# EAGLE board scoutfly (EAGLE 5.11), part 1 of 3
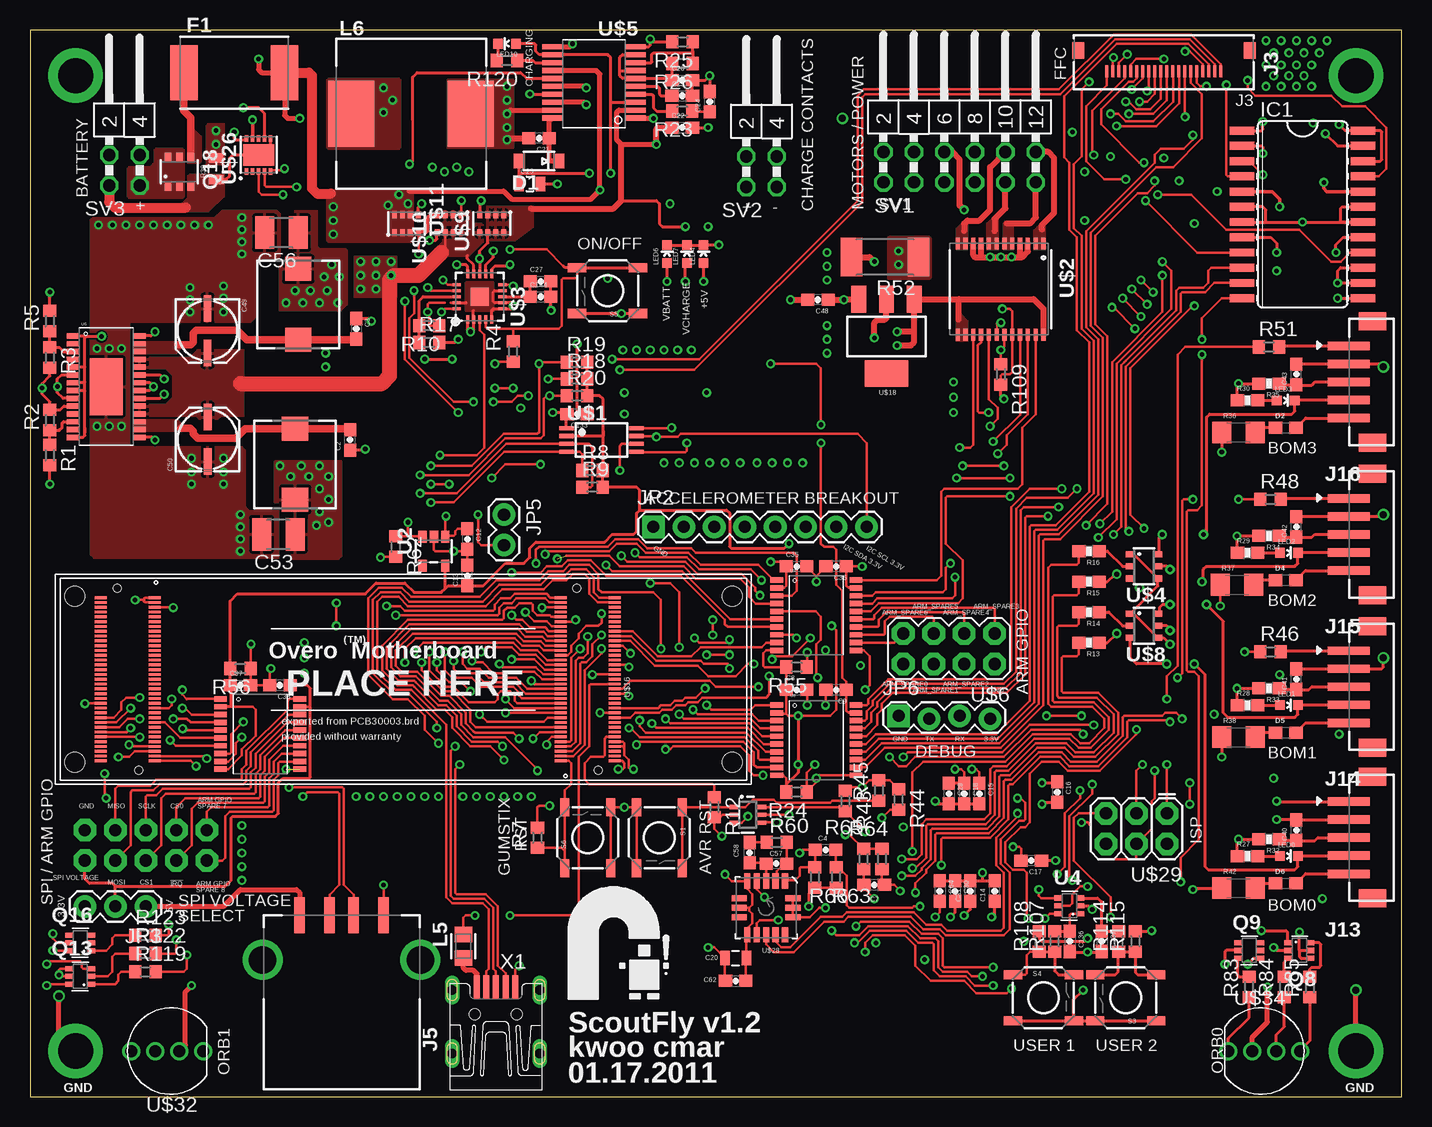
[diagram p7: board, top side]
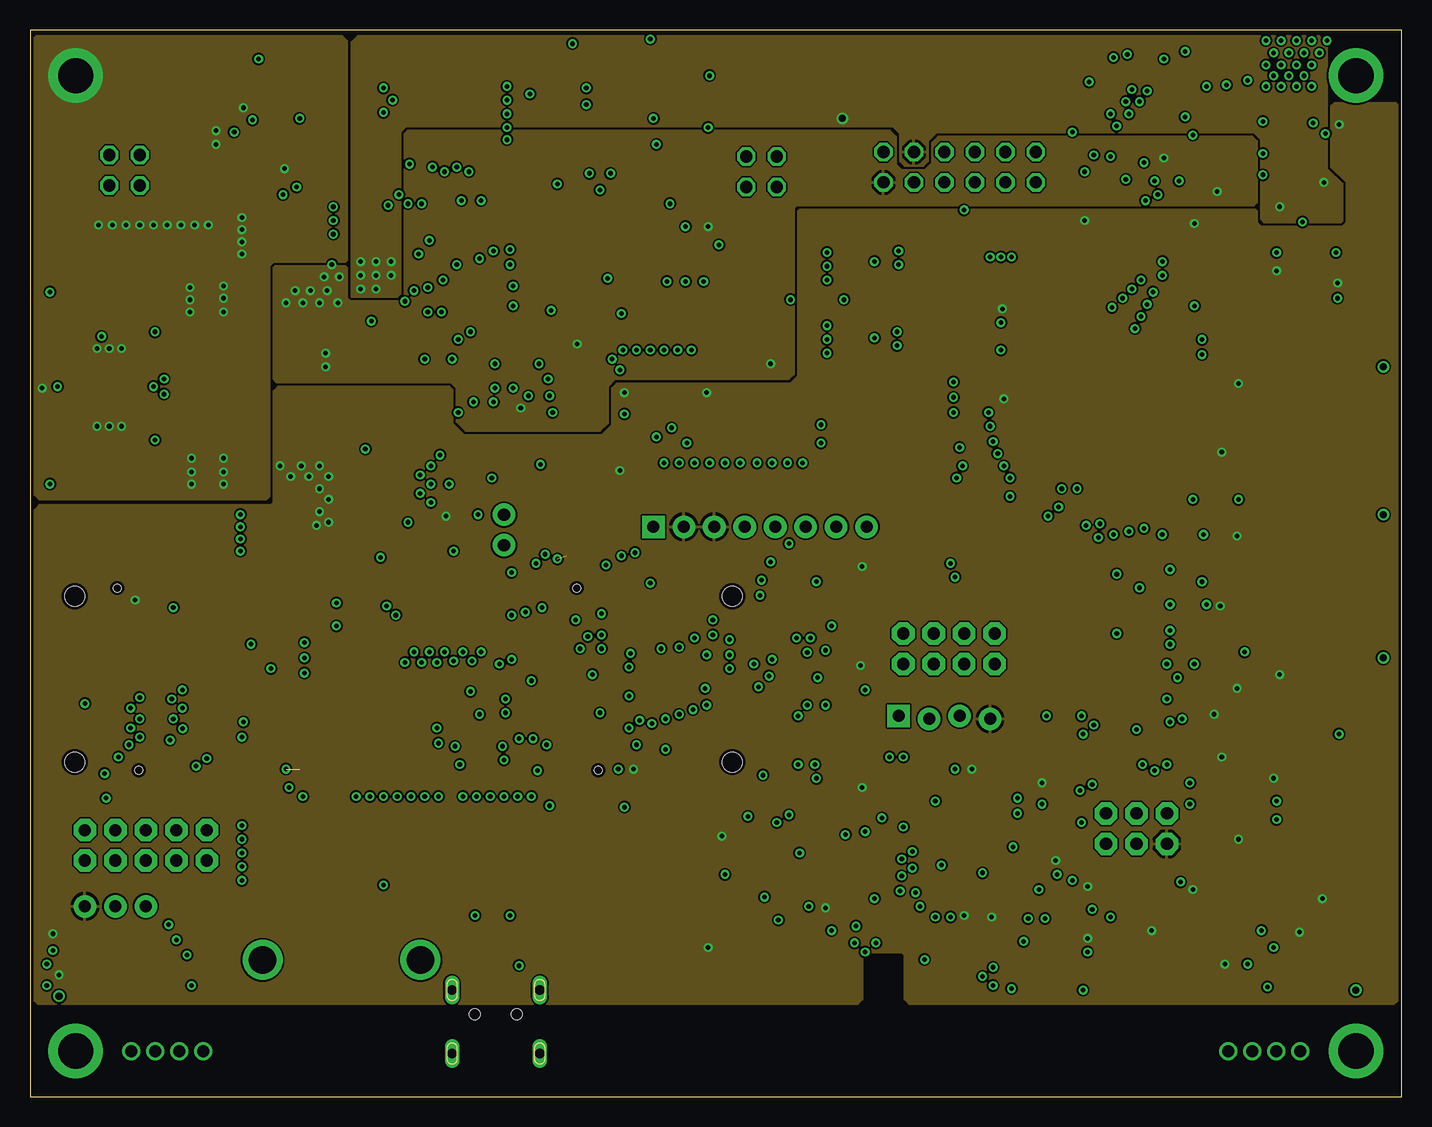
[diagram p8: board, inner layer Power]
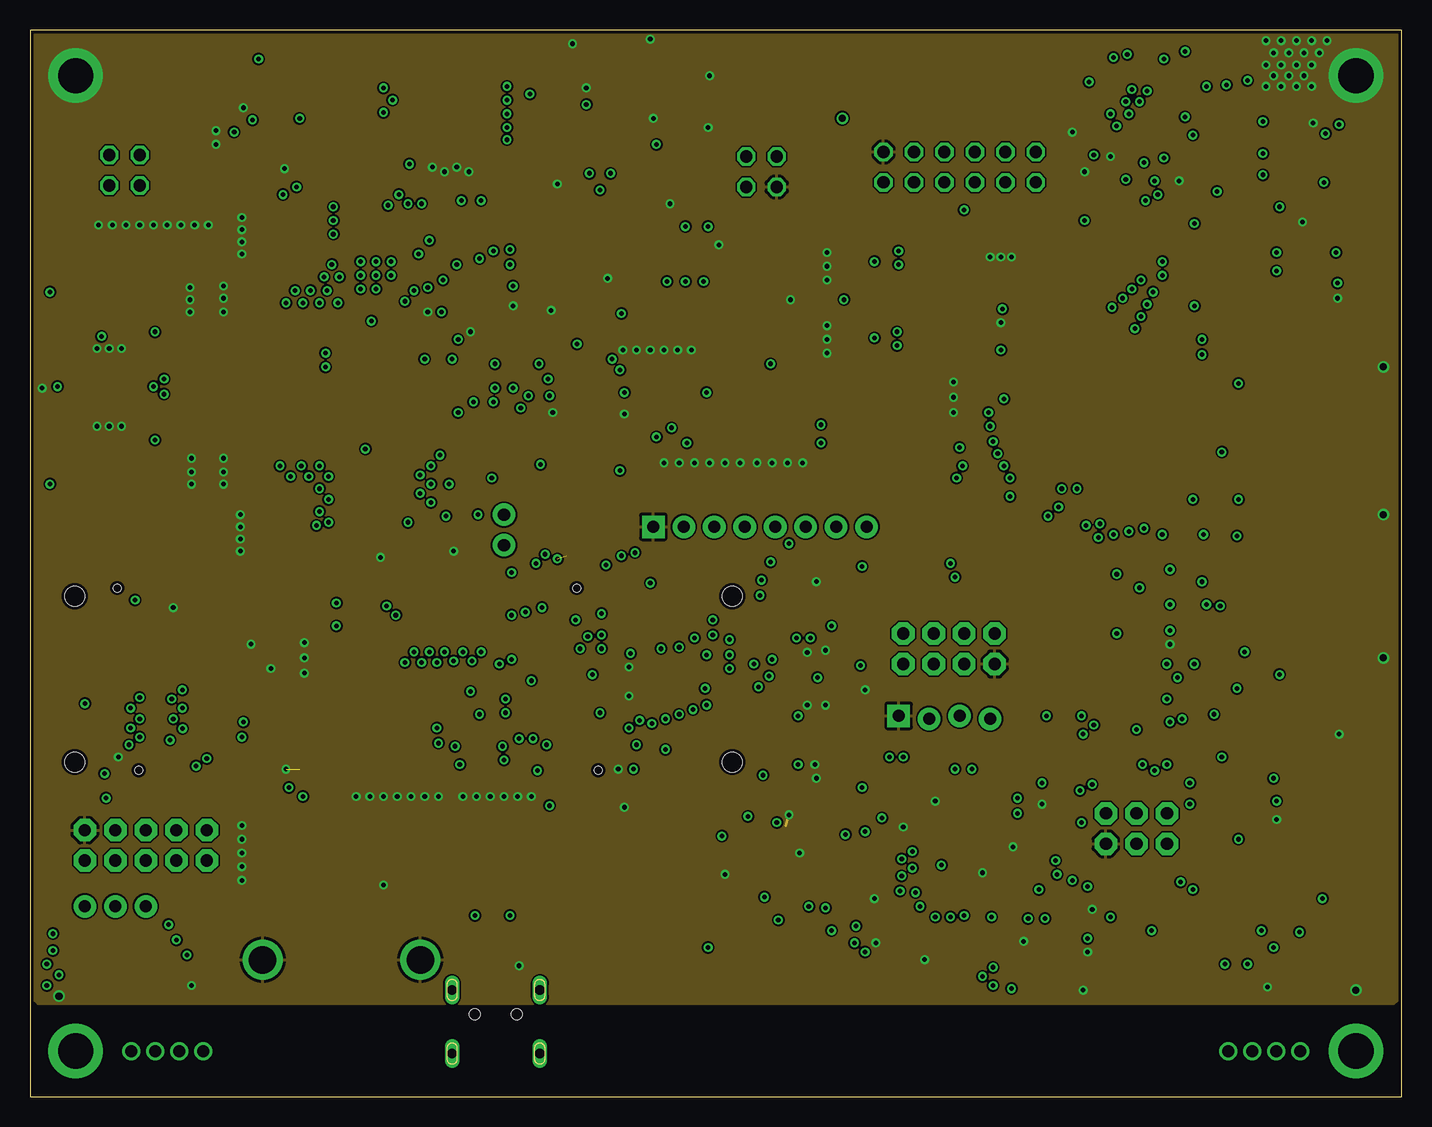
[diagram p9: board, inner layer GND]
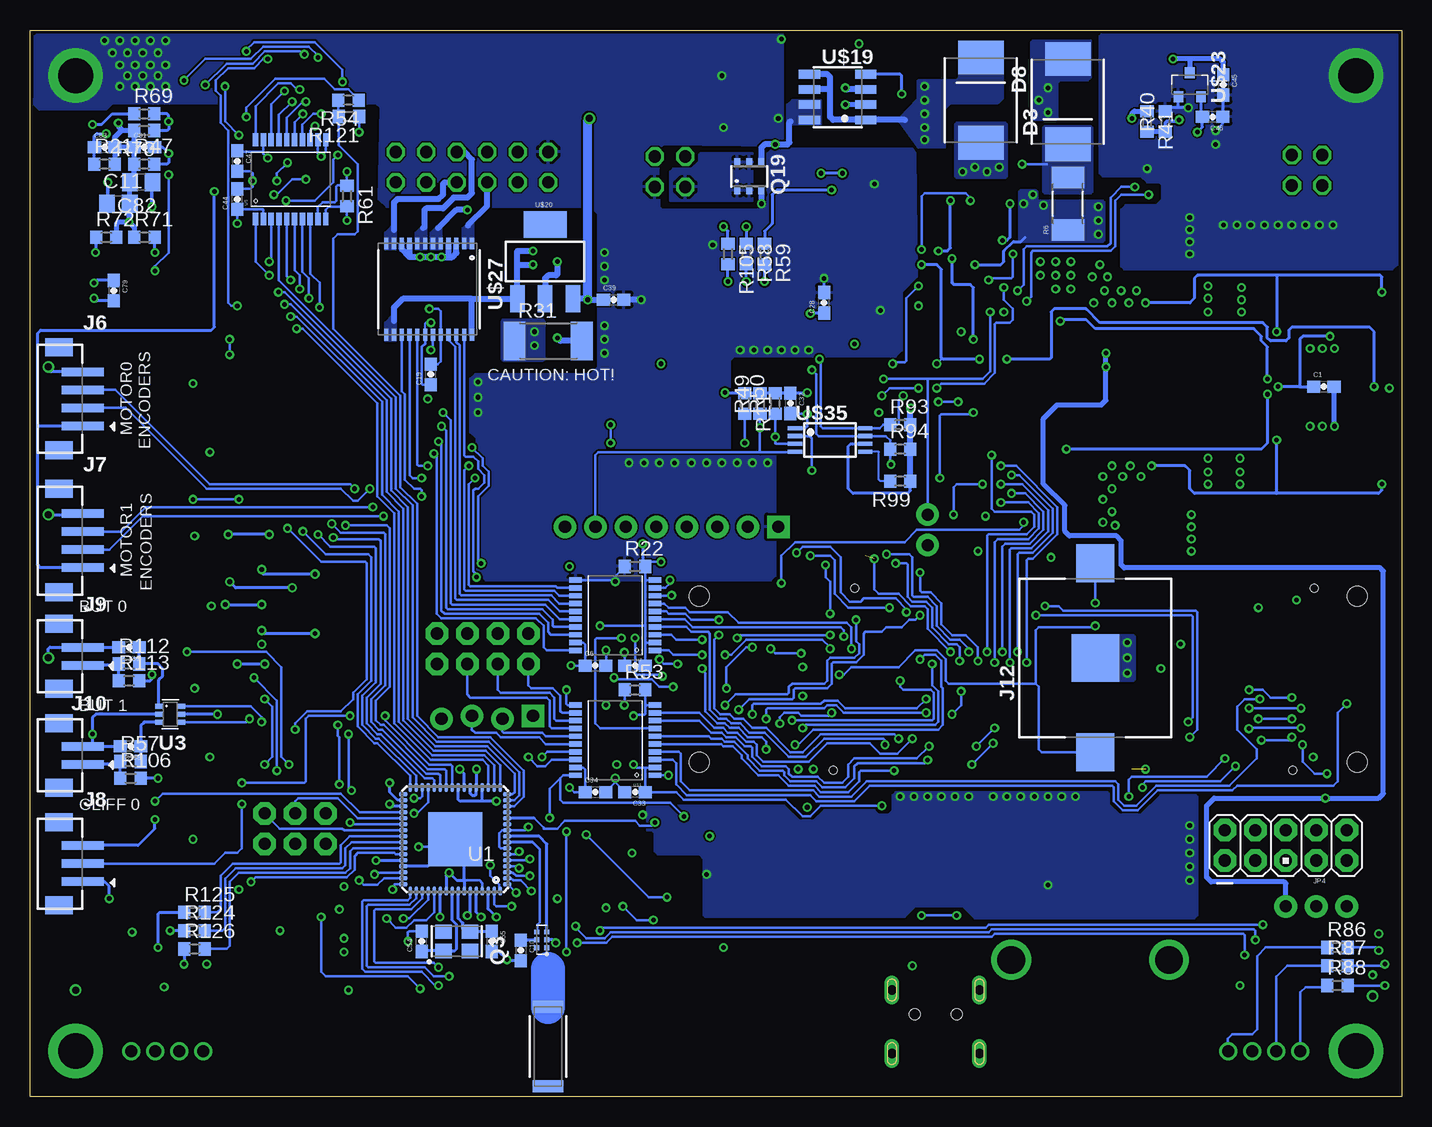
[diagram p10: board, bottom side, seen from below]

Size 114.3 x 88.9 mm. Coordinates in mm from the lower left corner, seen from the top.
Outline: 0,0 114.3,0 114.3,88.9 0,88.9 0,0
Copper layers (1*2+15*16): Top 0.0356mm / dielectric 1.5011mm / Power 0.0356mm / dielectric 0.1499mm / GND 0.0356mm / dielectric 0.2007mm / Bottom 0.0356mm
Design rules "4layer_6mil_15mil *": minimum track width 6mil, minimum drill 15mil, track to track 6mil, track to pad 6mil, pad to pad 6mil, via to via 6mil, smd to smd 6mil, copper to edge 10mil, drill to drill 8mil, minimum pad ring 7mil, minimum via ring 7mil, stop-mask expansion 4mil, vias tented up to drill 0mil, thermal gap 10mil

## Footprints (pad centres in the part's own frame; a part is rotated, then mirrored left to right if it is on the bottom)
CHIP_ANT_2.4GHZ = smd 1.016 x 2.54: 1 -3.302,0; 2 3.302,0
0603-CAP = smd 1.1 x 1: 1 -0.85,0; 2 0.85,0
C0805 = smd 1.3 x 1.5: 1 -0.95,0; 2 0.95,0
0805 = smd 0.8 x 1.2: 1 -0.9,0; 2 0.9,0
PANASONIC_C = smd 2.2 x 0.65: + 1.9,-0.2; - -1.8,-0.2
R1210 = smd 1.6 x 2.7: 1 -1.4,0; 2 1.4,0
SOD-123 = smd 0.914 x 1.219: 1 -1.638,0; 2 1.638,0
0603 = smd 1.1 x 1: 1 -0.85,0; 2 0.85,0
SMC/DO-214AB = smd 2.8 x 3.8: 1 -3.55,0; 2 3.55,0
SM200 = smd 2.3 x 4.6: 1 -4.2,0; 2 4.2,0
SO24W = smd 0.66 x 2.032: 1 -6.985,-5.029; 2 -5.715,-5.029; 3 -4.445,-5.029; 4 -3.175,-5.029; 5 -1.905,-5.029; 6 -0.635,-5.029; 7 0.635,-5.029; 8 1.905,-5.029; 9 3.175,-5.029; 10 4.445,-5.029; 11 5.715,-5.029; 12 6.985,-5.029; 13 6.985,5.029; 14 5.715,5.029; 15 4.445,5.029; 16 3.175,5.029; 17 1.905,5.029; 18 0.635,5.029; 19 -0.635,5.029; 20 -1.905,5.029; 21 -3.175,5.029; 22 -4.445,5.029; 23 -5.715,5.029; 24 -6.985,5.029
OMRON_XF = smd 0.25 x 1: 1 -4.75,0; 2 -4.25,0; 3 -3.75,0; 4 -3.25,0; 5 -2.75,0; 6 -2.25,0; 7 -1.75,0; 8 -1.25,0; 9 -0.75,0; 10 -0.25,0; 11 0.25,0; 12 0.75,0; 13 1.25,0; 14 1.75,0; 15 2.25,0; 16 2.75,0; 17 3.25,0; 18 3.75,0; 19 4.25,0; 20 4.75,0 | smd 1 x 1.34: SOLDER_PAD1 -7.14,-1.72; SOLDER_PAD2 7.14,-1.72
USB_A = smd 0.9 x 3: 1 -3.5,0; 2 -1,0; 3 1,0; 4 3.5,0 | drill 2.3 round: CASE1 -6.57,-3.71; CASE2 6.57,-3.71
JST_ZH_4 = smd 0.7 x 3.5: 1 -2.25,-2; 2 -0.75,-2; 3 0.75,-2; 4 2.25,-2 | smd 1.5 x 2.3: CASE1 -4.3,0; CASE2 4.3,0
JST_ZH_3 = smd 0.7 x 3.5: 1 -1.5,-2; 2 0,-2; 3 1.5,-2 | smd 1.5 x 2.3: CASE1 -3.45,0; CASE2 3.45,0
JST_ZH_2 = smd 0.7 x 3.5: 1 -0.75,-2; 2 0.75,-2 | smd 1.5 x 2.3: CASE1 -2.7,0; CASE2 2.7,0
COIN_CELL = smd 3.962 x 3.962: NEGATIVE 0,0 | smd 3.175 x 3.175: PLUS1 -7.874,0; PLUS2 7.874,0
JST_ZH_5 = smd 0.7 x 3.5: 1 -3.012,-2.508; 2 -1.512,-2.508; 3 -0.012,-2.508; 4 1.488,-2.508; 5 3.012,-2.508 | smd 1.5 x 2.3: CASE1 -5.062,-0.508; CASE2 5.062,-0.508
1X08 = drill 1.016 pad 1.88 square: 1 0,0 | drill 1.016 pad 1.88 round: 2 2.54,0; 3 5.08,0; 4 7.62,0; 5 10.16,0; 6 12.7,0; 7 15.24,0; 8 17.78,0
1X03 = drill 1.016 pad 1.88 round: 1 0,0; 2 2.54,0; 3 5.08,0
AVR_ICSP = drill 1.016 pad 1.88 octagon: 1 -1.27,5.08; 2 1.27,5.08; 3 -1.27,2.54; 4 1.27,2.54; 5 -1.27,0; 6 1.27,0; 7 -1.27,-2.54; 8 1.27,-2.54; 9 -1.27,-5.08; 10 1.27,-5.08
1X02 = drill 1.016 pad 1.88 round: 1 0,0; 2 2.54,0
1X04_LOCK = drill 1.016 pad 1.88 square: 1 0,0.127 | drill 1.016 pad 1.88 round: 2 2.54,-0.127; 3 5.08,0.127; 4 7.62,-0.127
WURTH_BALUN = smd 0.4 x 0.4: 1 -0.425,0.65; 2 -0.425,0; 3 -0.425,-0.65; 4 0.425,-0.65; 5 0.425,0; 6 0.425,0.65
RLF7030 = smd 2 x 2.2: 1 -2.95,0; 2 2.95,0
0805' = smd 1.285 x 1.47: 1 -0.973,0; 2 0.973,0
DR125 = smd 3.85 x 5.5: 1 -4.975,0; 2 4.975,0
LED-0603 = smd 0.8 x 0.8: A 0,-0.75; C 0,0.75
NX3225SA = smd 1.4 x 1.2: 1 -1.1,-0.8; 2 1.1,-0.8; 3 1.1,0.8; 4 -1.1,0.8
SOT363 = smd 0.42 x 0.6: 1 -0.65,-0.95; 2 0,-0.95; 3 0.65,-0.95; 4 0.65,0.95; 5 0,0.95; 6 -0.65,0.95
SOT26 = smd 0.55 x 0.8: 1 -0.95,-1.2; 2 0,-1.2; 3 0.95,-1.2; 4 0.95,1.2; 5 0,1.2; 6 -0.95,1.2
6-TSOP = smd 0.508 x 0.699: 1 -1.001,-1.163; 2 0,-1.163; 3 1.001,-1.163; 4 1.001,1.163; 5 0,1.163; 6 -1.001,1.163
R0603 = smd 1 x 1.1: 1 -0.85,0; 2 0.85,0
R2010 = smd 1.8 x 2.7: 1 -2.2,0; 2 2.2,0
0603-RES = smd 1.1 x 1: 1 -0.85,0; 2 0.85,0
R2512 = smd 1.8 x 3.2: 1 -2.8,0; 2 2.8,0
1206 = smd 1.6 x 1.8: 1 -1.4,0; 2 1.4,0
TACTILE_SWITCH_SMD = smd 1.524 x 0.762: 1 -2.54,1.905; 2 2.54,1.905; 3 -2.54,-1.905; 4 2.54,-1.905
MA06-2W = drill 1.016 octagon: 1 -7.62,-1.27; 2 -7.62,1.27; 3 -5.08,-1.27; 4 -5.08,1.27; 5 -2.54,-1.27; 6 -2.54,1.27; 7 0,-1.27; 8 0,1.27; 9 2.54,-1.27; 10 2.54,1.27; 11 5.08,-1.27; 12 5.08,1.27
MA02-2W = drill 1.016 octagon: 1 -1.27,-5.08; 2 -1.27,-2.54; 3 1.27,-5.08; 4 1.27,-2.54
MLF64-TH = smd 0.7 x 0.3: 1 -4.325,3.75; 2 -4.325,3.25; 3 -4.325,2.75; 4 -4.325,2.25; 5 -4.325,1.75; 6 -4.325,1.25; 7 -4.325,0.75; 8 -4.325,0.25; 9 -4.325,-0.25; 10 -4.325,-0.75; 11 -4.325,-1.25; 12 -4.325,-1.75; 13 -4.325,-2.25; 14 -4.325,-2.75; 15 -4.325,-3.25; 16 -4.325,-3.75; 33 4.325,-3.75; 34 4.325,-3.25; 35 4.325,-2.75; 36 4.325,-2.25; 37 4.325,-1.75; 38 4.325,-1.25; 39 4.325,-0.75; 40 4.325,-0.25; 41 4.325,0.25; 42 4.325,0.75; 43 4.325,1.25; 44 4.325,1.75; 45 4.325,2.25; 46 4.325,2.75; 47 4.325,3.25; 48 4.325,3.75 | smd 0.3 x 0.7: 17 -3.75,-4.325; 18 -3.25,-4.325; 19 -2.75,-4.325; 20 -2.25,-4.325; 21 -1.75,-4.325; 22 -1.25,-4.325; 23 -0.75,-4.325; 24 -0.25,-4.325; 25 0.25,-4.325; 26 0.75,-4.325; 27 1.25,-4.325; 28 1.75,-4.325; 29 2.25,-4.325; 30 2.75,-4.325; 31 3.25,-4.325; 32 3.75,-4.325; 49 3.75,4.325; 50 3.25,4.325; 51 2.75,4.325; 52 2.25,4.325; 53 1.75,4.325; 54 1.25,4.325; 55 0.75,4.325; 56 0.25,4.325; 57 -0.25,4.325; 58 -0.75,4.325; 59 -1.25,4.325; 60 -1.75,4.325; 61 -2.25,4.325; 62 -2.75,4.325; 63 -3.25,4.325; 64 -3.75,4.325 | smd 4.5 x 4.5: TH 0,0
5-SOT23 = smd 0.7 x 1: 1 -0.95,-1.2; 2 0,-1.2; 3 0.95,-1.2; 4 0.95,1.2; 5 -0.95,1.2
20-TSSOP = smd 1.05 x 0.45: 1 -3.3,2.925; 2 -3.3,2.275; 3 -3.3,1.625; 4 -3.3,0.975; 5 -3.3,0.325; 6 -3.3,-0.325; 7 -3.3,-0.975; 8 -3.3,-1.625; 9 -3.3,-2.275; 10 -3.3,-2.925; 11 3.3,-2.925; 12 3.3,-2.275; 13 3.3,-1.625; 14 3.3,-0.975; 15 3.3,-0.325; 16 3.3,0.325; 17 3.3,0.975; 18 3.3,1.625; 19 3.3,2.275; 20 3.3,2.925
TSSOP28 = smd 1.05 x 0.45: 1 -2.775,4.225; 2 -2.775,3.575; 3 -2.775,2.925; 4 -2.775,2.275; 5 -2.775,1.625; 6 -2.775,0.975; 7 -2.775,0.325; 8 -2.775,-0.325; 9 -2.775,-0.975; 10 -2.775,-1.625; 11 -2.775,-2.275; 12 -2.775,-2.925; 13 -2.775,-3.575; 14 -2.775,-4.225; 15 2.775,-4.225; 16 2.775,-3.575; 17 2.775,-2.925; 18 2.775,-2.275; 19 2.775,-1.625; 20 2.775,-0.975; 21 2.775,-0.325; 22 2.775,0.325; 23 2.775,0.975; 24 2.775,1.625; 25 2.775,2.275; 26 2.775,2.925; 27 2.775,3.575; 28 2.775,4.225 | smd 2.74 x 4.75: PAD 0,0
6-SOT23 = smd 0.35 x 0.85: 1 -0.65,-1.1; 2 0,-1.1; 3 0.65,-1.1; 4 0.65,1.1; 5 0,1.1; 6 -0.65,1.1
TSSOP8 = smd 1.2 x 0.35: 1 -2.925,0.975; 2 -2.925,0.325; 3 -2.925,-0.325; 4 -2.925,-0.975; 5 2.925,-0.975; 6 2.925,-0.325; 7 2.925,0.325; 8 2.925,0.975
24-SSOP = smd 0.35 x 0.97: 1 0,-3.81; 2 0.65,-3.81; 3 1.3,-3.81; 4 1.95,-3.81; 5 2.6,-3.81; 6 3.25,-3.81; 7 3.9,-3.81; 8 4.55,-3.81; 9 5.2,-3.81; 10 5.85,-3.81; 11 6.5,-3.81; 12 7.15,-3.81; 13 7.15,3.81; 14 6.5,3.81; 15 5.85,3.81; 16 5.2,3.81; 17 4.55,3.81; 18 3.9,3.81; 19 3.25,3.81; 20 2.6,3.81; 21 1.95,3.81; 22 1.3,3.81; 23 0.65,3.81; 24 0,3.81
20-QFN = smd 0.7 x 0.25: 1 -1.9,1; 2 -1.9,0.5; 3 -1.9,0; 4 -1.9,-0.5; 5 -1.9,-1; 11 1.9,-1; 12 1.9,-0.5; 13 1.9,0; 14 1.9,0.5; 15 1.9,1 | smd 0.25 x 0.7: 6 -1,-1.9; 7 -0.5,-1.9; 8 0,-1.9; 9 0.5,-1.9; 10 1,-1.9; 16 1,1.9; 17 0.5,1.9; 18 0,1.9; 19 -0.5,1.9; 20 -1,1.9 | smd 1.5 x 1.5: 21 0,0
20-SSOP = smd 1.651 x 0.432: 1 -3.48,5.944; 2 -3.48,5.283; 3 -3.48,4.623; 4 -3.48,3.962; 5 -3.48,3.302; 6 -3.48,2.642; 7 -3.48,1.981; 8 -3.48,1.321; 9 -3.48,0.66; 10 -3.48,0; 11 3.48,0; 12 3.48,0.66; 13 3.48,1.321; 14 3.48,1.981; 15 3.48,2.642; 16 3.48,3.302; 17 3.48,3.962; 18 3.48,4.623; 19 3.48,5.283; 20 3.48,5.944
2X4 = drill 1.016 pad 1.88 octagon: 1 -3.81,-1.27; 2 -3.81,1.27; 3 -1.27,-1.27; 4 -1.27,1.27; 5 1.27,-1.27; 6 1.27,1.27; 7 3.81,-1.27; 8 3.81,1.27
1206-8_CHIPFET = smd 0.406 x 0.559: 1 -0.991,-0.737; 2 -0.33,-0.737; 3 0.33,-0.737; 4 0.991,-0.737; 5 0.991,0.737; 6 0.33,0.737; 7 -0.33,0.737; 8 -0.991,0.737
OVERO = smd 1 x 0.23: ADCIN2 17.6,-2; ADCIN3 17.6,2; ADCIN4 17.6,5.2; ADCIN5 17.6,0.8; ADCIN6 17.6,0; ADCIN7 17.6,-4.4; AGND 17.6,1.2; AUXLF 17.6,6; AUXRF 17.6,4.8; EM_A1 -25.2,2; EM_A2 -20.7,2.8; EM_A3 -25.2,2.4; EM_A4 -25.2,3.2; EM_A5 -20.7,2; EM_A6 -25.2,1.6; EM_A7 -20.7,1.6; EM_A8 -20.7,2.4; EM_A9 -25.2,3.6; EM_A10 -25.2,2.8; EM_CLK -25.2,6.8; EM_D0 -25.2,1.2; EM_D1 -25.2,0; EM_D2 -20.7,1.2; EM_D3 -20.7,0.4; EM_D4 -20.7,-0.4; EM_D5 -20.7,-1.2; EM_D6 -25.2,-0.8; EM_D7 -25.2,-1.6; EM_D8 -25.2,0.4; EM_D9 -25.2,0.8; EM_D10 -20.7,0.8; EM_D11 -20.7,0; EM_D12 -20.7,-0.8; EM_D13 -25.2,-0.4; EM_D14 -25.2,-1.2; EM_D15 -20.7,-1.6; EM_NADV_ALE -20.7,4.4; EM_NBE0 -25.2,4.8; EM_NBE1 -25.2,6.4; EM_NCS0 -25.2,5.2; EM_NCS1 -25.2,4.4; EM_NCS4 -20.7,5.2; EM_NCS5_ETH0 -20.7,5.6; EM_NCS6 -25.2,5.6; EM_NOE -20.7,4; EM_NWE -20.7,4.8; EM_NWP -25.2,4; EM_WAIT0 -25.2,6; GND -20.7,6; GND@33 -20.7,-6; GND@56 17.6,-1.2; GND@70 17.6,-6.8; GPIO0_WAKEUP 13.1,-3.6; GPIO12_MMC3_CLK -25.2,-5.2; GPIO13_MMC3_CMD -20.7,-2; GPIO14_MMC3_DAT4 -20.7,-4.4; GPIO17_MMC3_D3 -20.7,-5.2; GPIO18_MMC3_D0 -20.7,-3.2; GPIO19_MMC3_D1 -25.2,-6.8; GPIO20_MMC3_D2 -25.2,-5.6; GPIO21_MMC3_DAT7 -20.7,-4.8; GPIO22_MMC3_DAT6 -25.2,-6.4; GPIO23_MMC3_DAT5 -25.2,-6; GPIO64_ETH0_NRESET -20.7,3.2; GPIO65_ETH1_IRQ1 -20.7,3.6; GPIO66_L_PCLK 13.1,5.6; GPIO67_L_LCLK 13.1,6.8; GPIO68_L_FCLK 13.1,6.4; GPIO69_L_BIAS 17.6,4; GPIO70_L_DD00 13.1,-6; GPIO71_L_DD01 13.1,-6.4; GPIO72_L_DD02 13.1,-4.8; GPIO73_L_DD03 13.1,-5.6; GPIO74_L_DD04 13.1,-4.4; GPIO75_L_DD05 13.1,-5.2; GPIO76_L_DD06 13.1,6; GPIO77_L_DD07 13.1,4.4; GPIO78_L_DD08 13.1,4.8; GPIO79_L_DD09 13.1,4; GPIO80_L_DD10 13.1,-2.8; GPIO81_L_DD11 13.1,-2.4; GPIO82_L_DD12 17.6,-2.8; GPIO83_L_DD13 13.1,-0.4; GPIO84_L_DD14 13.1,0.4; GPIO85_L_DD15 13.1,0.8; GPIO86_L_DD16 17.6,3.6; GPIO87_L_DD17 13.1,2.4; GPIO88_L_DD18 13.1,2.8; GPIO89_L_DD19 13.1,3.6; GPIO90_L_DD20 17.6,3.2; GPIO91_L_DD21 13.1,2; GPIO92_L_DD22 13.1,-1.2; GPIO93_L_DD23 17.6,-3.2; GPIO114_SPI1_NIRQ -25.2,-4.8; GPIO127_TS_IRQ 13.1,-4; GPIO128_GPS_PPS 13.1,-1.6; GPIO144_GPT9_PWM 13.1,0; GPIO145_GPT10_PWM 17.6,-0.8; GPIO146_GPT11_PWM 13.1,1.2; GPIO147_GPT8_PWM 13.1,-0.8; GPIO148_TXD1 -20.7,-2.4; GPIO149_MMC3_CD -25.2,-2.8; GPIO150_MMC3_WP -25.2,-2.4; GPIO151_RXD1 -25.2,-2; GPIO163_IR_CTS3 13.1,1.6; GPIO165_IR_RXD3 13.1,5.2; GPIO166_IR_TXD3 13.1,3.2; GPIO168_USBH_CPEN -20.7,-4; GPIO170_HDQ_1WIRE 17.6,2.4; GPIO171_SPI1_CLK -25.2,-4; GPIO172_SPI1_MOSI -25.2,-3.6; GPIO173_SPI1_MISO -25.2,-3.2; GPIO174_SPI1_CS0 -20.7,-3.6; GPIO175_SPI1_CS1 -25.2,-4.4; GPIO176_ETH0_IRQ -20.7,-2.8; GPIO184_I2C3_SCL 13.1,-2; GPIO185_I2C3_SDA 13.1,-3.2; HSOLF 17.6,-6; HSORF 17.6,-6.4; MIC_MAIN_MF 17.6,-1.6; MIC_SUB_MF 17.6,5.6; N_MANUAL_RESET 13.1,-6.8; NC@62 17.6,-3.6; NC@63 17.6,-4; POWERON 17.6,-4.8; PWM0 17.6,4.4; PWM1 17.6,1.6; SYSEN 17.6,-2.4; USBH_DM -20.7,-6.8; USBH_DP -20.7,-6.4; USBH_VBUS -20.7,-5.6; USBOTG_DM 17.6,6.4; USBOTG_DP 17.6,6.8; USBOTG_ID 17.6,2.8; USBOTG_VBUS 17.6,-0.4; VBACKUP 17.6,0.4; VSYSTEM@1 -20.7,6.8; VSYSTEM@2 -20.7,6.4; VSYSTEM@66 17.6,-5.2; VSYSTEM@67 17.6,-5.6 | hole 1.65: 27.4,6.9; 27.4,-6.9; -27.4,6.9; -27.4,-6.9 | hole 0.65: -23.85,7.6; -22.05,-7.6; 14.45,7.6; 16.25,-7.6
SOT223 = smd 1.219 x 2.235: 1 -2.311,-3.099; 2 0,-3.099; 3 2.311,-3.099 | smd 3.6 x 2.2: 4 0,3.099
8-SOIC = smd 0.72 x 1.78: 1 -1.905,-2.34; 2 -0.635,-2.34; 3 0.635,-2.34; 4 1.905,-2.34; 5 1.905,2.34; 6 0.635,2.34; 7 -0.635,2.34; 8 -1.905,2.34
SOT23 = smd 0.8 x 0.9: 1 -0.95,-1; 2 0.95,-1; 3 0,1
10-TDFN = smd 0.55 x 0.3: 1 -1.37,1; 2 -1.37,0.5; 3 -1.37,0; 4 -1.37,-0.5; 5 -1.37,-1; 6 1.37,-1; 7 1.37,-0.5; 8 1.37,0; 9 1.37,0.5; 10 1.37,1 | smd 1.8 x 2.6: 11 0,0
LGA16 = smd 1.27 x 0.508: 1 -2.235,1.575; 2 -2.235,0.787; 3 -2.235,0; 4 -2.235,-0.787; 5 -2.235,-1.575; 9 2.235,-1.575; 10 2.235,-0.787; 11 2.235,0; 12 2.235,0.787; 13 2.235,1.575 | smd 0.508 x 1.27: 6 -0.787,-2.235; 7 0,-2.235; 8 0.787,-2.235; 14 0.787,2.235; 15 0,2.235; 16 -0.787,2.235
2X3 = drill 1.016 pad 1.88 octagon: 1 0,0; 2 0,2.54; 3 2.54,0; 4 2.54,2.54; 5 5.08,0; 6 5.08,2.54
LED-TRICOLOR-THROUGHHOLE = drill 1 round: BLU 1,0; GND -1,0; GRN 3,0; RED -3,0
UX60-MB-5S8 = smd 2 x 0.5: 1 8.65,1.6; 2 8.65,0.8; 3 8.65,0; 4 8.65,-0.8; 5 8.65,-1.6 | drill 0.8 long: M1 3.1,-3.65; M2 3.1,3.65; M3 8.4,3.65; M4 8.4,-3.65 | hole 0.9: 6.4,-1.75; 6.4,1.75

## Placement (x,y rotation side)
A1  ANT-2.4-CHP  [CHIP_ANT_2.4GHZ]  71.12,4.19 270 bottom
C1  1uF  [0603-CAP]  6.48,59.18 0 bottom
C2  0.1uF  [0603-CAP]  26.67,54.74 90 top
C3  0.1uF  [0603-CAP]  27.18,64.01 270 top
C4  2.2uF  [0603-CAP]  66.29,20.57 180 top
C5  0.1uF  [0603-CAP]  63.88,35.94 180 bottom
C6  0.1uF  [0603-CAP]  67.18,35.94 0 bottom
C7  2.2uF  [0603-CAP]  70.36,17.65 180 top
C8  0.1uF  [0603-CAP]  63.88,33.91 0 top
C9  0.1uF  [0603-CAP]  67.18,33.91 180 top
C10  22pF  [0603-CAP]  73.41,12.19 270 bottom
C11  4.7uF  [C0805]  106.93,74.42 0 bottom
C12  1uF  [0603-CAP]  36.45,46.48 270 top
C13  1uF  [0603-CAP]  36.45,43.43 90 top
C14  1uF  [0603-CAP]  80.39,17.14 90 top
C15  1uF  [0603-CAP]  79.12,25.27 270 top
C16  1uF  [0603-CAP]  85.6,25.4 270 top
C17  1uF  [0603-CAP]  83.44,19.68 180 top
C18  1uF  [0603-CAP]  77.85,25.27 270 top
C19  0.1uF  [0603-CAP]  80.9,60.2 90 bottom
C20  10uF  [0805]  58.8,11.56 0 top
C21  0.1uF  [0603-CAP]  42.42,79.88 180 top
C22  0.1uF  [0603-CAP]  54.36,80.77 0 top
C23  4.7uF  [0805]  41.66,76.07 0 top
C24  0.1uF  [0603-CAP]  56.64,82.93 90 top
C25  0.047uF  [0603-CAP]  54.36,83.41 0 top
C26  0.1uF  [0603-CAP]  54.36,84.71 0 top
C27  0.1nF  [0603-CAP]  42.55,67.94 0 top
C28  0.1uF  [0603-CAP]  48.13,66.17 90 bottom
C29  1uF  [0603-CAP]  76.58,25.27 270 top
C30  1uF  [0603-CAP]  77.09,17.14 270 top
C31  1uF  [0603-CAP]  78.36,17.14 90 top
C32  0.1uF  [0603-CAP]  50.93,57.78 270 bottom
C33  0.1uF  [0603-CAP]  63.88,25.4 180 bottom
C34  0.1uF  [0603-CAP]  67.18,25.4 0 bottom
C35  0.1uF  [0603-CAP]  63.88,44.2 0 top
C36  0.1uF  [0603-CAP]  67.18,44.2 180 top
C37  0.1uF  [0603-CAP]  17.53,34.29 0 top
C38  0.1uF  [0603-CAP]  20.83,34.29 180 top
C39  0.1uF  [0603-CAP]  65.66,66.42 0 bottom
C40  0.1u  [0603-CAP]  105.54,22.23 90 top
C41  0.1u  [0603-CAP]  105.54,34.8 90 top
C42  0.1u  [0603-CAP]  105.54,47.5 90 top
C43  0.1u  [0603-CAP]  105.54,60.2 90 top
C44  0.1uF  [0603-CAP]  97.03,74.8 90 bottom
C45  1uF  [0603-CAP]  14.86,84.33 270 bottom
C46  1uF  [0603-CAP]  15.75,81.66 180 bottom
C47  0.1uF  [0603-CAP]  97.03,77.98 270 bottom
C48  0.1uF  [0603-CAP]  65.66,66.42 180 top
C49  47uF  [PANASONIC_C]  14.99,63.88 270 top
C50  47uF  [PANASONIC_C]  14.61,54.74 90 top
C53  22uF  [R1210]  20.7,46.86 180 top
C54  15pF  [0603-CAP]  81.66,12.95 90 bottom
C55  15pF  [0603-CAP]  75.82,12.95 270 bottom
C56  22uF  [R1210]  20.95,72.01 180 top
C57  0.01uF  [0603-CAP]  62.2,19.43 180 top
C58  0.47uF  [0603-CAP]  59.97,20.35 90 top
C62  0.1uF  [0603-CAP]  58.8,9.65 0 top
C64  0.1uF  [0603-CAP]  75.82,17.14 270 top
C79  0.1uF  [0603-CAP]  107.31,67.18 270 bottom
C81  680pF  [0603-CAP]  104.78,79.12 0 bottom
C82  4.7uF  [C0805]  105.03,76.2 180 bottom
C83  680pF  [0603-CAP]  108.08,79.12 0 bottom
C133  0.1uF  [0603-CAP]  45.59,56.9 180 top
C136  1uF  [0603-CAP]  86.65,12.95 270 top
C137  1uF  [0603-CAP]  89.32,12.95 270 top
C138  1uF  [0603-CAP]  105.92,29.21 180 bottom
C139  1uF  [0603-CAP]  106.05,37.47 180 bottom
C144  0.1nF  [0603-CAP]  42.55,66.67 0 top
D1  1N41482  [SOD-123]  42.42,77.98 0 top
D2  1V  [0603]  104.65,55.75 0 top
D3  MBRS340  [SMC/DO-214AB]  35.05,83.06 90 bottom
D4  1V  [0603]  104.65,43.05 0 top
D5  1V  [0603]  104.65,30.35 0 top
D6  1V  [0603]  104.65,17.78 0 top
D8  MBRS340  [SMC/DO-214AB]  27.81,82.93 270 bottom
F1  [SM200]  17.02,85.34 0 top
IC1  A3967SLB  [SO24W]  106.05,73.53 270 top
J3  XF2L  [OMRON_XF]  94.49,85.47 180 top
J5  USB_A  [USB_A]  25.96,15.12 0 top
J6  JST_4  [JST_ZH_4]  111.89,58.17 90 bottom
J7  JST_4  [JST_ZH_4]  111.89,46.35 90 bottom
J8  JST_3  [JST_ZH_3]  111.89,19.43 90 bottom
J9  JST_2  [JST_ZH_2]  111.89,36.7 90 bottom
J10  JST_2  [JST_ZH_2]  111.89,28.45 90 bottom
J12  KEYSTONE_3000  [COIN_CELL]  25.53,36.58 270 bottom
J13  JST_5VERT  [JST_ZH_5]  112.39,21.59 270 top
J14  JST_5VERT  [JST_ZH_5]  112.39,34.16 270 top
J15  JST_5VERT  [JST_ZH_5]  112.39,46.86 270 top
J16  JST_5VERT  [JST_ZH_5]  112.39,59.56 270 top
JP2  [1X08]  51.94,47.5 0 top
JP3  [1X03]  9.65,15.88 180 top
JP4  M05X2PTH  [AVR_ICSP]  9.65,20.95 90 bottom
JP5  [1X02]  39.5,48.51 270 top
JP6  [1X04_LOCK]  72.39,31.62 0 top
L1  WURTH_748421245  [WURTH_BALUN]  71.65,13.08 180 bottom
L2  1uH  [RLF7030]  22.1,52.7 90 top
L3  1.5uH  [RLF7030]  22.35,66.04 90 top
L5  MI0805K400R-10  [0805']  36.12,12.55 270 top
L6  22uH  [DR125]  31.75,81.92 0 top
LED0  GREEN  [LED-0603]  104.9,20.07 270 top
LED1  GREEN  [LED-0603]  104.9,32.64 270 top
LED2  GREEN  [LED-0603]  104.9,45.34 270 top
LED3  GREEN  [LED-0603]  104.65,58.04 270 top
LED4  Blue  [LED-0603]  56.13,70.23 0 top
LED6  Blue  [LED-0603]  53.09,70.23 0 top
LED7  Blue  [LED-0603]  54.74,70.23 0 top
LED10  Blue  [LED-0603]  39.75,87.76 90 top
Q3  16MHz  [NX3225SA]  78.74,12.95 0 bottom
Q8  DMMT3906W  [SOT363]  105.79,12.19 270 top
Q9  DMMT3906W  [SOT363]  101.6,12.19 90 top
Q13  DMMT3906W  [SOT363]  4.19,10.03 90 top
Q16  DMMT3906W  [SOT363]  4.19,12.83 90 top
Q18  DMP266LDM  [SOT26]  12.45,77.09 0 top
Q19  SI3493BDV  [6-TSOP]  54.36,76.71 0 bottom
R1  45.3K  [R0603]  1.65,53.47 270 top
R2  10K  [R0603]  1.65,56.39 90 top
R3  10K  [R0603]  1.65,61.59 270 top
R4  10K  [R0603]  40.26,62.1 90 top
R5  73.2K  [R0603]  1.65,64.64 90 top
R6  0.1, 1W  [R2010]  27.81,74.42 90 bottom
R7  10K  [R0603]  42.29,21.59 90 top
R8  487  [R0603]  46.86,52.2 0 top
R9  487  [R0603]  46.86,50.8 0 top
R10  100K  [R0603]  33.27,64.26 180 top
R11  200K  [R0603]  54.74,57.78 270 bottom
R12  10K  [R0603]  57.02,24.13 270 top
R13  2k  [0603-RES]  88.27,37.85 180 top
R14  2k  [0603-RES]  88.27,40.39 180 top
R15  2k  [0603-RES]  88.27,42.93 180 top
R16  2k  [0603-RES]  88.27,45.47 180 top
R17  845K  [R0603]  33.27,62.87 0 top
R18  10K  [R0603]  45.59,59.82 0 top
R19  10K  [R0603]  45.59,61.21 0 top
R20  10K  [R0603]  45.59,58.42 0 top
R21  20K  [R0603]  108.08,77.72 0 bottom
R22  10K  [R0603]  63.88,44.2 0 bottom
R23  10K  [R0603]  54.36,82.14 180 top
R24  10K  [R0603]  63.88,25.4 180 top
R25  100K  [R0603]  54.38,87.91 180 top
R26  100K  [R0603]  54.38,86.11 180 top
R27  68  [0603-RES]  101.47,20.07 0 top
R28  68  [0603-RES]  101.47,32.64 0 top
R29  68  [0603-RES]  101.47,45.34 0 top
R30  68  [0603-RES]  101.47,58.04 0 top
R31  0.8, > 1W  [R2512]  71.12,62.99 0 bottom
R32  100  [0603-RES]  103.25,21.46 180 top
R33  100  [0603-RES]  103.25,34.04 180 top
R34  100  [0603-RES]  103.25,46.74 180 top
R35  100  [0603-RES]  103.25,59.44 180 top
R36  4.7  [1206]  100.71,55.37 0 top
R37  4.7  [1206]  100.58,42.67 0 top
R38  4.7  [1206]  100.71,29.97 0 top
R39  0.01, 1%, 1/4W  [0805]  15.49,77.34 90 top
R40  49.9K  [R0603]  19.68,81.28 90 bottom
R41  49.9K  [R0603]  21.21,81.28 270 bottom
R42  4.7  [1206]  100.71,17.4 0 top
R43  10K  [R0603]  67.94,24.64 270 top
R44  10K  [R0603]  72.39,24.77 270 top
R45  10K  [R0603]  70.74,25.53 90 top
R46  10K  [R0603]  103.38,37.08 0 top
R47  20K  [R0603]  104.78,77.72 0 bottom
R48  10K  [R0603]  103.38,49.78 0 top
R49  976  [R0603]  53.47,57.78 90 bottom
R50  976  [R0603]  52.2,57.78 90 bottom
R51  10K  [R0603]  103.25,62.48 0 top
R52  0.8, > 1W  [R2512]  71.25,69.98 180 top
R53  10K  [R0603]  63.88,33.91 0 bottom
R54  5.11K  [R0603]  87.76,83.06 180 bottom
R55  10K  [R0603]  63.88,35.81 180 top
R56  10K  [R0603]  17.53,35.69 180 top
R57  30.1K  [R0603]  105.92,27.94 0 bottom
R58  432  [R0603]  54.61,70.23 270 bottom
R59  182  [R0603]  53.09,70.23 270 bottom
R60  10K  [R0603]  62.23,21.21 180 top
R61  10K  [R0603]  87.88,75.06 270 bottom
R62  10K  [R0603]  30.48,45.85 270 top
R63  33K  [R0603]  67.18,18.29 270 top
R64  33K  [R0603]  70.99,19.81 90 top
R65  1M  [R0603]  69.47,19.81 90 top
R66  1M  [R0603]  65.41,18.29 270 top
R69  9.76K  [R0603]  104.78,81.92 0 bottom
R70  442  [R0603]  104.78,80.52 180 bottom
R71  0.05  [R0603]  104.75,71.63 0 bottom
R72  0.05  [R0603]  107.95,71.63 0 bottom
R83  64.9  [R0603]  101.6,9.14 90 top
R84  18  [R0603]  104.52,9.14 90 top
R85  18  [R0603]  106.65,9.14 90 top
R86  64.9  [R0603]  5.33,12.45 0 bottom
R87  18  [R0603]  5.33,10.92 0 bottom
R88  18  [R0603]  5.33,9.27 0 bottom
R93  1.54K  [R0603]  41.78,56.01 0 bottom
R94  1.54K  [R0603]  41.78,53.98 0 bottom
R99  200K  [R0603]  41.78,51.31 180 bottom
R105  84.5  [R0603]  56.13,70.23 270 bottom
R106  32.4k  [R0603]  105.92,26.54 0 bottom
R107  30.1K  [R0603]  85.38,12.95 90 top
R108  32.4k  [R0603]  84.11,12.95 90 top
R109  10K  [R0603]  80.9,60.2 270 top
R112  30.1K  [R0603]  106.05,36.07 0 bottom
R113  32.4k  [R0603]  106.05,34.67 0 bottom
R114  30.1K  [R0603]  90.72,12.95 90 top
R115  32.4k  [R0603]  92.12,12.95 90 top
R119  10K  [R0603]  9.63,10.41 0 top
R120  105  [R0603]  39.75,86.36 180 top
R121  10K  [R0603]  87.73,81.69 180 bottom
R122  10K  [R0603]  9.63,11.94 0 top
R123  10K  [R0603]  9.63,13.46 0 top
R124  10K  [R0603]  100.58,13.84 0 bottom
R125  10K  [R0603]  100.58,15.37 0 bottom
R126  10K  [R0603]  100.58,12.32 0 bottom
S1  [TACTILE_SWITCH_SMD]  52.45,21.59 270 top
S3  [TACTILE_SWITCH_SMD]  91.31,8.26 180 top
S4  [TACTILE_SWITCH_SMD]  84.45,8.26 0 top
S5  [TACTILE_SWITCH_SMD]  48.13,67.18 180 top
S6  [TACTILE_SWITCH_SMD]  46.48,21.59 90 top
SV1  [MA06-2W]  78.74,77.47 0 top
SV2  MA02-2W  [MA02-2W]  60.96,80.9 0 top
SV3  MA02-2W  [MA02-2W]  7.87,81.03 0 top
U1  ATMEGA128RF  [MLF64-TH]  78.87,21.46 180 bottom
U2  TC1015  [5-SOT23]  33.66,45.47 180 top
U3  NL27WZ14  [SOT363]  102.62,31.88 270 bottom
U4  NL27WZ14  [SOT363]  86.61,15.92 90 top
U5  TXB0108  [20-TSSOP]  92.58,76.45 90 bottom
U6  LTC3633  [TSSOP28]  6.35,59.18 0 top
U7  TXB0108  [20-TSSOP]  65.53,40.13 180 bottom
U8  TXB0108  [20-TSSOP]  65.53,29.72 0 top
U9  TXB0108  [20-TSSOP]  65.53,40.13 0 top
U10  TXB0108  [20-TSSOP]  19.18,30.23 0 top
U11  TXB0108  [20-TSSOP]  65.53,29.72 180 bottom
U12  74LVC1G11  [6-SOT23]  59.82,23.5 270 top
U$1  PCA9306  [TSSOP8]  47.62,54.74 0 top
U$2  TB6612FNG  [24-SSOP]  84.45,67.31 180 top
U$3  LTC2952  [20-QFN]  37.47,66.67 90 top
U$4  BC817DS  [6-TSOP]  92.84,44.2 270 top
U$5  MAX745  [20-SSOP]  46.99,87.5 180 top
U$6  M04X2  [2X4]  76.58,37.34 180 top
U$7  ROBOLOGOSILKSCREEN  [RCLOGO]  48.64,11.18 0 top
U$8  BC817DS  [6-TSOP]  92.84,39.24 270 top
U$9  SI5401DC  [1206-8_CHIPFET]  38.48,72.77 180 top
U$10  SI5401DC  [1206-8_CHIPFET]  34.92,72.77 180 top
U$11  SI5401DC  [1206-8_CHIPFET]  31.37,72.77 0 top
U$16  OVERO  [OVERO]  31.11,34.8 0 top
U$18  V_REG_317SMD  [SOT223]  71.37,63.37 180 top
U$19  IRF7303  [8-SOIC]  46.99,83.31 90 bottom
U$20  V_REG_317SMD  [SOT223]  71.37,69.6 0 bottom
U$23  MCP1702  [SOT23]  17.65,84.33 0 bottom
U$26  DS2786  [10-TDFN]  19.05,78.49 90 top
U$27  TB6612FNG  [24-SSOP]  77.47,67.31 180 bottom
U$28  LPY5150AL  [LGA16]  61.34,15.75 270 top
U$29  AVR_SPI_PRG_6PTH  [2X3]  94.74,23.62 180 top
U$32  LED-TRICOLOR-THROUGHHOLE  [LED-TRICOLOR-THROUGHHOLE]  11.43,3.81 180 top
U$34  LED-TRICOLOR-THROUGHHOLE  [LED-TRICOLOR-THROUGHHOLE]  102.87,3.81 0 top
U$35  PCA9306  [TSSOP8]  47.62,54.74 0 bottom
X1  MINI-USB-UX60-MB-5S8  [UX60-MB-5S8]  38.83,0.5 90 top

## Tracks (layer width: path | path; a pad name or v marks a point on that pad's centre or on a via)
!ARM_RESET
  Top 0.203: U$16.N_MANUAL_RESET 44.9,28 45.09,27.81 45.09,26.04 44.58,25.53 S6.2 44.58,20.07 | 44.58,20.07 44.58,20.45 44.28,20.74 R7.1 | 44.58,20.07 S6.1
!AVR_ISP_RST  (via drill 0.38)
  Top 0.203: v90.04,14.99 90.04,16.64 87,19.68 87,23.24 87.38,23.62 U$29.5 | v81.79,9.02 81.41,8.64 78.87,8.64 77.85,9.65 75.06,9.65 73.79,10.92 73.79,12.57 72.9,13.46 70.23,13.46 69.6,12.83 v69.6,12.06 | v69.6,22.1 69.6,22.14 R43.2 | 67.65,24.13 67.65,24.08 R43.2 | U12.6 67.59,24.14 R43.2
  Bottom 0.203: v90.04,14.99 90.04,10.41 89.66,10.03 82.8,10.03 v81.79,9.02 | v69.6,12.06 v69.6,22.1
!AVR_RESET  (via drill 0.38)
  Top 0.203: v62.23,22.86 60.93,22.86 U12.4
  Bottom 0.203: 72.29,23.21 71.5,22.42 71.5,22.35 70.36,22.35 69.72,22.99 63.88,22.99 63.5,22.61 62.48,22.61 v62.23,22.86
  Bottom 0.254: 72.29,23.21 U1.12
!AVR_RESET_1.8V  (via drill 0.38)
  Top 0.203: U$16.GPIO86_L_DD16 50.12,38.4 52.2,36.32 55.88,36.32 56.13,36.07 58.17,36.07 58.29,35.94 v58.29,35.69 | v52.96,28.96 53.34,28.96 53.59,29.21 59.18,29.21 59.94,28.45 59.94,27.18 60.33,26.8 v61.09,26.8
  Bottom 0.203: v58.29,35.69 58.29,35.56 58.04,35.31 58.04,32.13 57.02,31.11 56.39,31.11 56.01,30.73 55.24,30.73 54.48,29.97 53.34,29.97 52.96,29.59 v52.96,28.96 | U11.1 v61.09,26.8 U11.1
  Bottom 0.254: U11.1
!AVR_RESET_3.3V  (via drill 0.38)
  Top 0.203: R44.2 71.67,23.91 v70.99,23.24 | U12.3 59.29,22.84 v59.82,23.37
  Bottom 0.203: U11.20 69.85,26.79 70.1,26.54 | 70.1,26.54 70.1,24.77 69.85,24.51 60.96,24.51 v59.82,23.37 | v70.99,23.24 70.99,25.65 70.1,26.54
!PWR_BATT  (via drill 0.38)
  Top 0.203: U$16.GPIO163_IR_CTS3 43.1,36.4 42.29,37.21 40.89,37.21 40.26,37.85 32.77,37.85 v32,37.08 | v32.51,51.82 36.58,51.82 39.62,54.86 42.55,54.86 42.8,55.12 42.8,58.17 43.05,58.42 v43.31,58.42 R20.1 | U$3.17 33.41,67.17 v33.15,67.44 | v40.26,59.05 v38.73,59.05
  Bottom 0.203: v32,37.08 32,45.21 31.88,45.34 30.73,45.34 29.08,46.99 29.08,49.02 31.88,51.82 v32.51,51.82 | v33.15,67.44 33.15,66.42 32.38,65.66 32.38,64.77 32.64,64.52 33.78,64.52 33.91,64.39 33.91,60.33 34.8,59.44 38.35,59.44 v38.73,59.05 | v40.26,59.05 42.67,59.05 v43.31,58.42
!PWR_INT  (via drill 0.38)
  Top 0.203: U$16.GPIO87_L_DD17 42.81,37.2 42.42,37.59 41.02,37.59 40.39,38.23 32.13,38.23 31.24,37.34 v31.24,36.2 | v33.4,52.58 36.83,52.58 39.5,55.24 42.29,55.24 42.42,55.37 v42.42,61.09 42.55,61.21 R19.1 | U$3.10 40.15,67.67 v40.26,67.56
  Bottom 0.203: v31.24,36.2 31.24,44.7 31.11,44.83 30.73,44.83 28.7,46.86 28.7,49.15 32.13,52.58 v33.4,52.58 | v40.26,67.56 41.27,66.55 41.27,61.34 41.4,61.21 42.29,61.21 v42.42,61.09
!PWR_KILL  (via drill 0.38)
  Top 0.203: U$16.GPIO127_TS_IRQ 37.15,30.8 36.7,31.24 36.7,32.26 35.18,33.78 34.42,33.78 32.64,35.56 v32.64,36.2 | v33.4,51.05 v34.92,51.05 | v37.34,48.51 37.34,46.23 37.59,45.97 JP5.2
  Bottom 0.203: v32.64,36.2 32.64,45.59 32.51,45.72 30.86,45.72 29.46,47.12 29.46,48.9 31.62,51.05 v33.4,51.05 | v34.92,51.05 37.08,51.05 37.34,50.8 v37.34,48.51
!SPI_IRQ
  Top 0.203: JP4.3 13.46,20.95 13.46,24 13.97,24.51 19.43,24.51 19.56,24.64 19.56,26.67 19.94,27.05 19.94,28.07 21.12,29.25 U10.14
!SPI_IRQ_1.8V  (via drill 0.38)
  Top 0.203: U10.7 12.15,29.25 v11.68,29.72 | U$16.GPIO114_SPI1_NIRQ 9.12,30 v9.14,29.97
  Bottom 0.203: v11.68,29.72 9.4,29.72 v9.14,29.97
!VBATT_GATE  (via drill 0.38)
  Top 0.254: U$9.4 37.49,74.57 v37.59,74.68 | U$3.12 37.97,69.33 38.61,69.98 v38.61,70.48
  Bottom 0.254: v37.59,74.68 37.59,70.74 37.85,70.48 v38.61,70.48
+1.8V  (via drill 0.38)
  Top 0.203: 63.03,31.92 R53.2 R55.2 61.21,35.81 61.09,35.94 61.09,36.96 61.34,37.21 U9.10 | U8.2 62.24,32 62.33,31.92 63.03,31.92 | U9.2 62.24,42.42 62.87,42.42 63.03,42.58 R22.2 62.65,44.58 v61.72,44.58 | U8.10 62.78,26.79 63.03,26.54 R24.2 | 63.03,31.92 63.2,31.75 v64.01,31.75 66.67,31.75 67.18,32.26 67.18,38.86 v66.8,39.24 | R7.2 42.29,24.13 42.42,24.26 v43.31,24.26 | U10.10 16.51,27.3 17.65,28.45 17.65,28.96 18.8,30.1 18.8,32.26 18.54,32.51 16.76,32.51
  Top 0.254: 34.6,42.35 U2.5 | 34.6,42.35 34.29,42.04 32,42.04 31.24,42.8 28.83,42.8 27.94,41.91 17.27,41.91 16.68,41.31 R56.2 C37.1 16.76,34.2 16.76,32.51 15.89,32.51 U10.2 | U10.10 | 34.6,42.35 34.84,42.58 C13.1 37.76,42.58 39.62,44.45 41.15,44.45 41.66,44.96 41.66,45.72 42.16,46.23 47.88,46.23 48.51,46.86 50.29,46.86 50.55,47.12 50.55,48.64 50.8,48.9 | 50.8,48.9 58.04,48.9 58.29,48.64 58.29,45.85 58.42,45.72 62.87,45.72 v63.25,46.1 | R24.2 63.03,26.04 64.01,27.01 v64.01,27.69 v64.01,31.75 | R19.2 R18.2 R20.2 47.5,58.42 47.75,58.17 47.75,55.5 | 50.8,48.9 50.8,50.55 50.55,50.8 R9.2 R8.2 47.75,52.24 47.75,55.5 | U$1.2 47.75,55.06 47.75,55.5
  Bottom 0.203: 62.24,37.85 U7.2 63.02,37.86 63.03,37.85 | U11.10 63.03,32.64 | U7.10 63.03,43.05 | U11.2 62.24,27.43 63.12,27.43 | v61.72,44.58 62.65,44.58 R22.2 63.03,43.05 | 63.03,37.85 C5.1 R55.2 | 63.03,43.05 63.03,39.24 | 63.03,39.24 63.03,37.85 | 63.03,32.64 63.03,31.92 63.09,31.85 63.91,31.85 v64.01,31.75 | 63.03,32.64 R53.2 | 63.03,39.24 v66.8,39.24 | 63.12,27.43 63.75,27.43 v64.01,27.69 | 63.12,27.43 63.03,27.34 R24.2 60.45,25.4 59.82,24.77 51.31,24.77 49.91,23.37 49.28,23.37 48.39,24.26 v43.31,24.26
  Bottom 0.254: v63.25,46.1 63.25,44.41 R22.2
+3V3  (via drill 0.38)
  Top 0.203: U$16.VSYSTEM@66 49.4,29.59 49.53,29.46 49.53,29.06 | U9.19 68.21,42.41 68.03,42.58 C36.1 v69.34,44.2 | 81.7,65.62 81.86,65.47 U$2.20 81.86,60.39 81.66,60.2 81.03,60.2 80.9,60.07 R109.2 | 81.66,65.66 v81.03,65.66 | U$16.VSYSTEM@2 9.6,41.2 9.53,41.27 | 9.53,41.27 9.53,41.53 9.59,41.6 U$16.VSYSTEM@1 | v8.76,41.4 9.4,41.4 9.53,41.27 | v50.29,27.3 50.04,27.3 49.91,27.43 49.91,28.07 49.53,28.45 49.53,29.06 | U$16.VSYSTEM@67 49.39,29.2 49.53,29.06 | v34.67,48.39 34.6,48.32 U2.1 34.67,46.74 35.31,46.74 35.43,46.86 35.43,47.12 35.65,47.33 C12.1 | U4.5 86.65,15.91 86.87,16.13 86.87,16.89 87.5,17.53 v88.14,17.53 | v49.15,52.2 49.15,54.23 49.33,54.41 U$1.6 | Q13.5 2.54,10.03 v2.41,10.16 2.41,10.54 2.54,10.67 3.23,10.67 Q13.4 | v1.91,13.59 1.91,13.21 2.29,12.83 Q16.5 | v102.74,76.83 101.6,77.98 IC1.3 | U12.2 57.75,23.5 57.53,23.28 R12.2 57.02,22.35 v57.66,21.72 | R44.1 71.63,26.38 R45.2 69.94,26.38 v69.34,25.78 68.24,25.78 R43.1 | U$28.14 63.78,14.96 | U$28.14 U$28.15 U$28.16 | C62.1 57.9,9.7 C20.1 57.01,12.45 v56.52,12.45 | U$28.14 65,14.96 65.79,15.75 v66.29,15.75 | C15.1 79.12,27.05 78.87,27.3 v78.49,27.3 | v99.19,40.89 v99.18,40.9 R37.1
  Top 0.254: v85.47,19.68 C17.1 | Q8.4 105.93,11.54 105.79,11.68 105.79,12.19 | 105.79,12.19 v105.79,13.72 | 105.79,12.19 Q8.5 | R115.2 93.43,13.8 v93.47,13.84 | v88.14,13.21 87.88,12.95 84.33,12.95 84.11,13.17 R108.2 | C14.1 80.39,15.24 v80.14,14.99 | 81.7,65.62 81.66,65.66 | v84.33,26.16 85.51,26.16 C16.1 | R42.1 97.03,17.4 v96.9,17.27 | R27.1 100.62,21.38 v100.71,21.46 R32.2 | v99.31,28.32 R38.1 | R28.1 100.58,32.68 v100.58,34.04 R33.2 | R29.1 100.62,46.7 v100.58,46.74 R34.2 | R36.1 v99.31,53.72 | R30.1 100.62,59.35 v100.71,59.44 R35.2 | Q9.5 99.69,12.19 99.57,12.06 v99.57,11.05 | R109.2 80.9,58.42 v81.15,58.17 | v77.85,15.11 78.36,15.62 C31.1 | IC1.14 v108.97,67.82 108.97,68.83 109.22,69.09 IC1.15 | IC1.22 112.52,77.98 112.65,78.11 112.65,80.39 112.52,80.52 IC1.24 109.6,80.52 v109.09,81.03 | U6.15 10.19,54.96 v10.41,54.74 | v1.65,51.05 R1.2
  Bottom 0.203: U7.19 68.82,37.85 68.2,37.85 68.03,37.68 C6.1 v69.22,35.94 | U11.19 68.2,27.43 68.03,27.27 C34.1 68.96,25.4 v69.34,25.78 | v81.03,65.66 80.26,65.66 80.07,65.47 U$27.20 80.07,61.28 80.3,61.05 C19.2 | U5.10 89.66,73.92 89.41,74.17 87.92,74.17 | 87.92,74.17 R61.2 | 87.92,74.17 87.92,73.06 v87.88,73.03 | U5.2 94.86,73.9 94.91,73.95 C44.1 v97.03,72.77 | v49.15,52.2 49.15,54.86 49.35,55.06 U$35.2 | v102.74,76.83 102.74,70.36 103.89,69.22 v103.89,68.83 | v80.14,14.99 80.14,15.07 80.12,15.09
  Bottom 0.254: v85.47,19.68 83.22,19.68 U1.44 | U1.23 78.12,26.94 v78.49,27.3 | 80.12,15.09 U1.54 | U1.34 83.64,24.71 84.33,25.4 v84.33,26.16 | v49.53,58.67 49.57,58.63 C32.1 R50.2 R49.2 R11.1 56.35,58.63 v56.39,58.67 | v103.63,26.54 R106.2 | U1.59 77.62,15.35 v77.85,15.11 | C79.1 108.75,68.03 v108.97,67.82 | R69.1 107.44,81.92 108.33,81.03 v109.09,81.03 | v20.83,52.58 18.03,52.58 17.65,52.2 17.65,50.67 17.27,50.29 10.41,50.29 | 10.41,50.29 1.91,50.29 1.65,50.55 v1.65,51.05 | 10.41,50.29 v10.41,54.74 | v98.68,31.88 U3.5 | R113.2 104.27,34.67 104.14,34.8 v104.14,35.18 | v107.7,16.51 107.7,17.53 108.08,17.91 109.86,17.91 J8.1
  other vias: 21.72,51.69 22.61,52.58 23.24,51.69 24.13,52.58 24.89,51.69 24.13,50.67 24.89,49.78 24.13,48.77 24.89,47.88 23.88,47.62
  pour Top: 21.84,44.83 21.84,49.53 20.45,49.53 20.45,52.96 25.91,52.96 25.91,45.09 25.65,44.83 23.62,44.83
  pour Power: 20.32,49.53 20.32,58.8 20.7,59.18 34.92,59.18 35.18,58.93 35.18,56.13 36.2,55.12 47.62,55.12 48.51,56.01 48.51,59.05 48.9,59.44 63.37,59.44 64.01,60.07 64.01,73.79 64.14,73.91 102.11,73.91 102.23,73.79 102.23,72.9 102.62,72.52 109.35,72.52 109.73,72.9 109.73,76.2 108.46,77.47 108.46,82.55 108.71,82.8 113.79,82.8 113.92,82.68 113.92,8 113.67,7.75 73.28,7.75 72.9,8.13 72.9,11.81 72.64,12.06 69.72,12.06 69.34,11.68 69.34,8.13 68.96,7.75 0.64,7.75 0.38,8 0.38,48.9 0.76,49.28 20.07,49.28
+5V  (via drill 0.38)
  Top 0.203: U8.19 68.21,31.99 68.03,32.17 C9.1 68.03,34.58 67.69,34.92 67.69,42.16 67.18,42.67 67.18,45.59 66.93,45.85 66.17,45.85 65.91,46.1 v65.91,54.48 | v65.91,56.01 65.91,60.71 65.53,61.09 v61.72,61.09 | U$16.USBH_VBUS 8.39,29.2 v8.26,29.34 | v6.22,26.92 6.22,25.02 v6.35,24.89
  Top 0.254: U6.28 10.07,63.41 v10.41,63.75 | R5.2 v1.65,67.06 | C133.1 45.72,56.9 45.59,57.02 v45.59,62.74
  Top 0.406: J5.1 22.46,17.04 22.23,17.27 17.53,17.27 16.13,15.88 JP3.1
  Bottom 0.203: 94.86,78.88 U5.19 | 94.86,78.88 95,78.74 96.94,78.74 C47.1 | 94.86,78.88 94.86,78.6 v94.49,78.23 | v65.91,54.48 v65.91,56.01 | v8.26,29.34 8.26,27.94 7.24,26.92 v6.22,26.92
  Bottom 0.254: J7.1 113.45,44.1 113.67,44.32 113.67,55.63 | J6.1 113.67,55.92 113.67,55.63 | v21.34,66.17 17.65,66.17 17.27,66.55 17.27,68.2 17.02,68.45 10.29,68.45 | 10.29,68.45 1.78,68.45 1.65,68.33 v1.65,67.06 | v10.41,63.75 10.41,68.45 10.29,68.45 | R105.1 56.13,72.14 v56.52,72.52 | U$35.6 45.92,54.41 46.1,54.23 46.1,50.67 45.72,50.29 41.15,50.29 40.93,50.51 R99.1 | 113.67,55.63 113.67,63.63 113.41,63.88 99.19,63.88 98.93,64.14 v98.93,75.44
  Bottom 0.406: JP3.1 9.65,17.78 9.78,17.91 15.88,17.91 16.26,18.29 16.26,24.26 15.62,24.89 v6.35,24.89 1.91,24.89 1.52,25.27 1.52,43.81 1.78,44.07 23.11,44.07 23.37,44.32 23.37,46.35 23.75,46.74 27.69,46.74 28.07,47.12 28.07,49.28 29.84,51.05 29.84,56.52 28.7,57.66 25.02,57.66 24.64,58.04 v24.64,60.83 v24.64,61.98
  Bottom 0.508: R99.1 R94.2 R93.2 40.93,57.37 v40.89,57.4
  other vias: 22.1,67.18 22.73,66.17 23.37,67.18 24.13,66.17 24.77,67.18 25.65,66.17 25.78,68.33 24.51,68.33 25.15,69.34
  pour Top: 22.1,73.79 22.1,69.22 20.83,69.22 20.83,65.53 25.91,65.53 26.42,66.04 26.42,70.48 26.29,70.61 24.13,70.61 23.88,70.87 23.88,73.79
  pour Power: 20.32,59.82 20.32,69.09 20.45,69.22 26.29,69.22 26.42,69.09 26.42,66.55 26.67,66.29 30.73,66.29 31.24,66.8 31.24,80.26 31.5,80.52 71.63,80.52 72.14,80.01 72.14,77.72 72.64,77.22 74.55,77.22 75.18,77.85 75.18,79.5 75.69,80.01 101.85,80.01 102.23,79.63 102.23,74.55 101.98,74.3 63.88,74.3 63.63,74.04 63.63,60.2 63.25,59.82 48.77,59.82 48.13,59.18 48.13,56.13 47.5,55.5 36.32,55.5 35.56,56.26 35.56,59.05 35.05,59.56 20.57,59.56
ACCES_DETECT
  Bottom 0.203: U1.14 73.96,24.21 73.15,25.02 73.15,27.18 75.95,29.97 80.26,29.97 82.04,31.75 82.04,49.4 83.44,50.8 83.44,58.42 89.03,64.01 89.03,71.5 88.65,71.88 87.25,71.88 87,72.14 87,77.72 88.58,79.31 R121.2 | R121.2 88.61,81.66 | R54.2 88.61,81.71 R121.2
ACCES_DETECT_RAW  (via drill 0.38)
  Top 0.203: v96.27,81.66 96.24,81.69 J3.7
  Bottom 0.203: v96.27,81.66 96.27,82.42 93.85,84.84 89.79,84.84 88.9,83.95 87.8,83.95 R54.1
ACCES_PIN0_3.3V  (via drill 0.38)
  Top 0.203: v93.6,67.06 v92.58,68.07
  Bottom 0.203: U1.16 74.1,25.21 73.91,25.4 73.91,26.92 76.2,29.21 80.52,29.21 82.8,31.5 82.8,49.15 84.2,50.55 84.2,58.17 93.09,67.06 v93.6,67.06 | U5.5 92.91,68.4 v92.58,68.07
ACCES_PIN0_5V  (via drill 0.38)
  Top 0.203: J3.11 94.24,83.19 93.34,82.3 92.2,82.3 91.57,82.93 v91.31,82.93
  Bottom 0.203: U5.16 92.91,81.59 91.57,82.93 v91.31,82.93
ACCES_PIN1_3.3V  (via drill 0.38)
  Top 0.203: v93.09,66.04 v91.82,67.31
  Bottom 0.203: U1.17 75.12,27.62 76.33,28.83 80.64,28.83 83.19,31.37 83.19,49.02 84.58,50.42 84.58,58.04 92.58,66.04 v93.09,66.04 | U5.6 92.26,68.89 91.82,68.45 v91.82,67.31
ACCES_PIN1_5V  (via drill 0.38)
  Top 0.203: v91.57,81.92 93.6,81.92 94.74,83.06 J3.10
  Bottom 0.203: U5.15 92.26,81.21 91.57,81.9 v91.57,81.92
ACCES_PIN2_3.3V  (via drill 0.38)
  Top 0.203: v92.58,65.02 v91.06,66.55
  Bottom 0.203: U1.18 75.62,27.61 76.45,28.45 80.77,28.45 83.57,31.24 83.57,48.77 84.96,50.16 84.96,57.91 92.08,65.02 v92.58,65.02 | U5.7 91.61,68.75 91.06,68.2 v91.06,66.55
ACCES_PIN2_5V  (via drill 0.38)
  Top 0.203: J3.9 95.25,82.93 93.6,81.28 91.31,81.28 90.68,81.92 v90.04,81.92
  Bottom 0.203: U5.14 91.61,80.98 90.68,81.92 v90.04,81.92
ACCES_PIN3_3.3V  (via drill 0.38)
  Top 0.203: v92.08,64.01 90.3,65.79 v90.17,65.79
  Bottom 0.203: U1.19 76.12,27.6 76.58,28.07 80.9,28.07 83.95,31.11 83.95,48.64 85.34,50.04 85.34,57.78 91.57,64.01 v92.08,64.01 | U5.8 90.96,68.61 90.17,67.82 v90.17,65.79
ACCES_PIN3_5V  (via drill 0.38)
  Top 0.203: J3.8 95.76,85.45 95.76,82.8 93.85,80.9 v90.55,80.9
  Bottom 0.203: U5.13 90.93,79.78 90.93,80.52 v90.55,80.9
ARM_PWR_ON
  Top 0.203: U$16.POWERON 48.03,30 47.88,29.84 47.88,28.45 47.75,28.32 46.74,28.32 46.23,27.81 46.23,26.42 46.61,26.04 56.9,26.04 57.02,25.91 R12.1
ARM_SPARE0_1.8V  (via drill 0.38)
  Top 0.203: U$16.GPIO88_L_DD18 42.92,37.6 42.55,37.97 41.15,37.97 40.51,38.61 31.88,38.61 30.48,37.21 30.48,35.94 30.99,35.43 32.26,35.43 34.29,33.4 34.92,33.4 36.32,32 36.32,31.11 36.96,30.48 37.08,30.35 40.26,30.35 v40.77,29.84
  Bottom 0.203: U11.9 58.54,31.99 57.28,30.73 56.52,30.73 56.13,30.35 55.37,30.35 54.61,29.59 53.98,29.59 53.72,29.34 53.72,28.45 53.21,27.94 49.4,27.94 47.88,29.46 44.32,29.46 43.43,28.57 42.04,28.57 v40.77,29.84
ARM_SPARE0_3.3V
  Bottom 0.203: U11.12 69.97,31.99 70.1,32.13 70.1,33.4 70.74,34.04 72.52,34.04 72.77,34.29 U$6.8
ARM_SPARE1_1.8V  (via drill 0.38)
  Top 0.203: U$16.GPIO89_L_DD19 43.14,38.4 42.8,38.73 41.4,38.73 40.77,39.37 31.62,39.37 29.72,37.47 29.72,35.69 30.73,34.67 32,34.67 32.13,34.54 34.04,32.64 34.67,32.64 35.56,31.75 35.56,30.86 36.83,29.59 38.99,29.59 v39.37,29.21
  Bottom 0.203: U11.8 58.52,31.34 57.53,30.35 56.64,30.35 56.26,29.97 55.5,29.97 54.74,29.21 54.23,29.21 54.1,29.08 54.1,28.32 53.34,27.56 51.31,27.56 51.05,27.3 51.05,26.92 50.8,26.67 48.64,26.67 48.13,26.16 46.61,26.16 46.1,26.67 46.1,27.69 45.59,28.19 40.39,28.19 v39.37,29.21
ARM_SPARE1_3.3V
  Bottom 0.203: U11.13 70.46,31.34 70.61,31.5 70.61,33.27 70.99,33.66 75.06,33.66 75.31,33.91 U$6.6
ARM_SPARE2_1.8V  (via drill 0.38)
  Top 0.203: U$16.GPIO90_L_DD20 50.01,38 52.07,35.94 54.48,35.94 | 54.48,35.94 55.24,35.94 | 54.48,35.94 55.63,35.94 56.52,35.05 58.8,35.05 59.82,36.07 v60.33,36.07 | v61.85,36.45 62.1,36.7 63.5,36.7 v65.02,38.23
  Bottom 0.203: v60.33,36.07 61.47,36.07 v61.85,36.45 | v65.02,38.23 67.06,38.23 67.18,38.1 67.18,31.11 66.76,30.69 U11.7
ARM_SPARE2_3.3V
  Bottom 0.203: U$6.4 77.85,33.53 77.6,33.27 71.25,33.27 70.99,33.02 70.99,30.86 70.83,30.69 U11.14
ARM_SPARE3_1.8V  (via drill 0.38)
  Top 0.203: U9.6 58.36,39.81 54.36,43.81 48.51,43.81 v48.01,44.32 | U$16.GPIO91_L_DD21 44.8,36.8 45.09,37.08 45.09,37.59 45.72,38.23 45.72,38.61 46.35,39.24 47.37,39.24 47.62,39.5 v47.62,40.26
  Bottom 0.203: v48.01,44.32 48.01,43.31 47.62,42.93 v47.62,40.26
ARM_SPARE3_3.3V
  Top 0.203: U9.15 70.29,39.81 70.36,39.88 70.36,40.13 70.99,40.77 80.26,40.77 80.39,40.64 U$6.1
ARM_SPARE4_1.8V  (via drill 0.38)
  Top 0.203: U9.7 58.12,39.16 57.91,39.37 57.91,39.75 54.23,43.43 48.01,43.43 46.74,44.7 44.83,44.7 44.32,44.2 43.05,44.2 42.55,43.69 v40.13,43.69 | U$16.GPIO92_L_DD22 41.33,33.6 40.39,34.54 37.85,34.54 37.08,35.31 35.69,35.31 35.31,35.69 v35.31,36.32
  Bottom 0.203: v35.31,36.32 35.31,37.47 36.32,38.48 37.47,38.48 38.35,39.37 38.35,41.15 39.24,42.04 40.01,42.04 40.13,42.16 v40.13,43.69
ARM_SPARE4_3.3V
  Top 0.203: U9.14 70.65,39.16 70.74,39.24 70.74,39.75 71.37,40.39 77.72,40.39 77.85,40.26 U$6.3
ARM_SPARE5_1.8V  (via drill 0.38)
  Top 0.203: U$16.GPIO93_L_DD23 50.01,31.6 50.42,32 52.45,32 52.7,32.26 53.47,32.26 53.85,32.64 54.61,32.64 54.86,32.89 55.63,32.89 56.01,33.27 61.34,33.27 61.59,33.53 v61.59,35.05 | U9.8 63.6,38.51 v63.88,38.23
  Bottom 0.203: v63.88,38.23 63.88,35.31 63.75,35.18 61.72,35.18 v61.59,35.05
ARM_SPARE5_3.3V
  Top 0.203: U9.13 71.15,38.51 71.25,38.61 71.25,39.62 71.63,40.01 75.18,40.01 75.31,39.88 U$6.5
ARM_SPARE6_1.8V
  Top 0.203: U$16.GPIO69_L_BIAS 50.23,38.8 52.32,36.7 55.12,36.7 55.88,37.47 60.96,37.47 61.35,37.86 U9.9 62.22,37.85
ARM_SPARE6_3.3V
  Top 0.203: U9.12 72.02,37.86 U$6.7
ARM_SPARE7
  Top 0.203: JP4.2 14.73,23.75 15.11,24.13 19.81,24.13 19.94,24.26 19.94,26.54 20.32,26.92 20.32,27.94 20.98,28.6 U10.13
ARM_SPARE7_1.8V  (via drill 0.38)
  Top 0.203: U$16.GPIO68_L_FCLK 43.26,41.2 42.93,41.53 40.51,41.53 40.13,41.15 39.5,41.15 39.12,40.77 39.12,40.26 38.99,40.13 v30.48,40.13 | U10.8 16.66,28.6 16.76,28.7 16.76,30.23 v17.78,31.24
  Bottom 0.203: v30.48,40.13 17.53,40.13 17.4,40.01 17.4,31.62 v17.78,31.24
ARM_SPARE8
  Top 0.203: JP4.1 16,19.68 16.26,19.94 16.26,23.37 16.64,23.75 20.19,23.75 20.32,23.88 20.32,26.42 20.7,26.8 20.7,27.81 20.83,27.94 22.47,27.94 U10.12
ARM_SPARE8_1.8V  (via drill 0.38)
  Top 0.203: U$16.GPIO67_L_LCLK 43.37,41.6 43.05,41.91 40.39,41.91 40.01,41.53 39.24,41.53 38.73,41.02 38.73,40.64 38.61,40.51 31.24,40.51 30.86,40.89 v29.72,40.89 | v17.65,29.97 17.14,29.46 17.14,28.57 16.51,27.94 U10.9
  Bottom 0.203: v29.72,40.89 28.57,40.89 28.19,40.51 17.14,40.51 17.02,40.39 17.02,30.61 v17.65,29.97
ARM_SYSEN  (via drill 0.38)
  Top 0.203: U$16.SYSEN 52.34,32.4 52.58,32.64 53.34,32.64 53.72,33.02 54.36,33.02 54.61,33.27 55.5,33.27 v56.26,34.04 | v54.1,37.47 54.1,42.04 53.34,42.8 v51.69,42.8 | v31.5,47.88 31.5,46.74 31.46,46.7 R62.1 32.67,46.7 U2.3
  Bottom 0.203: v56.26,34.04 56.26,35.81 54.61,37.47 v54.1,37.47 | v51.69,42.8 51.69,45.09 50.55,46.23 41.4,46.23 40.39,47.24 31.88,47.24 31.5,47.62 v31.5,47.88
AVR_MISO  (via drill 0.38)
  Top 0.203: R51.1 96.27,62.48 95.63,61.85 95.63,35.94 94.74,35.05 v94.74,33.15 | U$29.1 v94.74,27.69
  Bottom 0.203: U1.39 88.13,22.21 88.27,22.35 93.47,22.35 U$29.1 | v94.74,27.69 94.11,28.32 94.11,32.51 v94.74,33.15
AVR_MOSI  (via drill 0.38)
  Top 0.203: v87.63,22.86 88.14,22.86 88.39,22.61 88.39,20.45 89.03,19.81 92.08,19.81 92.2,19.94 U$29.4 93.47,22.35 93.47,24.64 93.73,24.89 v93.73,27.18 | v100.71,49.78 R48.1 | v96.9,49.78 96.14,49.78 96.01,49.66 96.01,35.31 v95.63,34.92
  Bottom 0.203: U1.38 87.48,22.71 v87.63,22.86 | v96.9,49.78 v100.71,49.78 | v95.63,34.92 93.73,33.02 v93.73,27.18
AVR_RFN
  Bottom 0.254: U1.9 71.88,21.72 71.23,21.06 L1.3
AVR_RFP
  Bottom 0.203: 71.82,20.64 71.82,14.54 72.01,14.35 72.01,13.8 L1.4
  Bottom 0.254: 71.82,20.64 72.39,21.21 U1.8
AVR_SCK  (via drill 0.38)
  Top 0.203: v101.22,37.08 R46.1 | v92.71,27.69 92.2,27.18 U$29.3
  Bottom 0.203: U1.37 86.97,23.21 88.65,24.89 91.95,24.89 92.2,24.64 U$29.3 | v92.71,27.69 93.34,28.32 93.34,35.81 94.61,37.08 v101.22,37.08
AVR_UART_RX_1.8V  (via drill 0.38)
  Top 0.203: U$16.GPIO148_TXD1 11.57,32.4 11.81,32.64 v11.81,33.15
  Bottom 0.203: U11.4 60.24,28.74 60.07,28.57 60.07,26.29 59.31,25.53 49.02,25.53 48.51,25.02 45.85,25.02 44.58,26.29 23.88,26.29 23.62,26.04 23.62,24.77 23.11,24.26 22.1,24.26 20.45,25.91 14.35,25.91 12.06,28.19 12.06,28.96 13.72,30.61 13.72,32.51 13.08,33.15 v11.81,33.15
AVR_UART_RX_3.3V  (via drill 0.38)
  Top 0.203: v71.63,28.32 72.39,27.56 73.03,27.56 73.79,28.32 81.15,28.32 83.44,30.61 87.5,30.61 87.76,30.35 v87.76,30.23 | v87.5,25.53 87.5,24.89 86.23,23.62 86.23,19.18 v85.6,18.54
  Bottom 0.203: 83.24,18.67 U1.46 83.15,18.67 85.47,18.67 v85.6,18.54 | U11.17 71.21,28.74 v71.63,28.32 | v87.76,30.23 87.76,25.78 v87.5,25.53
AVR_UART_TX_1.8V  (via drill 0.38)
  Top 0.203: U$16.GPIO151_RXD1 4.6,32.8 v4.57,32.77
  Bottom 0.203: U11.3 60.73,28.09 60.45,27.81 60.45,26.04 59.56,25.15 49.28,25.15 48.77,24.64 45.59,24.64 44.32,25.91 24.13,25.91 24,25.78 24,24.64 23.24,23.88 21.97,23.88 20.32,25.53 14.1,25.53 13.72,25.91 5.71,25.91 5.33,26.29 5.33,32 v4.57,32.77
AVR_UART_TX_3.3V  (via drill 0.38)
  Top 0.203: v72.77,28.32 73.15,28.7 81.03,28.7 83.31,30.99 v88.65,30.99 | v88.52,26.04 88.52,25.27 86.61,23.37 86.61,18.29 v86.87,18.03
  Bottom 0.203: U11.18 70.84,28.09 71.37,27.56 72.01,27.56 v72.77,28.32 | v88.65,30.99 88.65,30.1 88.52,29.97 v88.52,26.04 | U1.47 84.78,18.21 85.34,17.65 86.49,17.65 v86.87,18.03
BATT_GND
  Top 0.254: U$26.6 20.05,78.6 19.94,78.49 U$26.11 16.89,78.49 16.64,78.23 16.64,76.71 16.37,76.44 R39.1
  Top 0.813: SV3.1 6.6,74.55 7.06,74.09 12.98,74.09
  pour Top (no thermals): 13.34,76.83 16.13,76.83 16.13,75.06 14.86,73.79 12.7,73.79 12.7,74.42 13.21,74.93 13.21,76.71
BATT_VSENSE  (via drill 0.38)
  Top 0.305: U$26.9 v18.55,81.4 v18.54,81.41
  Bottom 0.305: R40.1 19.68,81.15 19.56,81.28 18.67,81.28 v18.54,81.41
  Bottom 0.406: R40.1 R41.2
BOM_E_HI0
  Top 0.254: D6.2 106.31,18.59 106.32,18.58 J13.5
BOM_E_HI1
  Top 0.254: D5.2 106.31,31.16 106.32,31.15 J14.5
BOM_E_HI2
  Top 0.254: D4.2 106.31,43.86 106.32,43.85 J15.5
BOM_E_HI3
  Top 0.254: D2.2 106.31,56.56 106.32,56.55 J16.5
BOM_E_LO0  (via drill 0.41)
  Top 0.254: LED0.C 105.68,20.09 | LED0.C 105.66,20.05 105.66,19.18 105.41,18.92 98.17,18.92 97.92,19.18 97.92,35.18 v97.03,36.07 | J13.4 105.69,20.1 LED0.C | v94.74,36.07 92.2,36.07 91.69,36.58 91.69,38.22 U$8.3
  Bottom 0.254: v97.03,36.07 v94.74,36.07
BOM_E_LO1  (via drill 0.41)
  Top 0.254: LED1.C 105.68,32.66 | LED1.C 105.65,31.86 105.41,31.62 99.82,31.62 99.44,32 99.44,39.62 v98.04,41.02 | J14.4 105.69,32.67 LED1.C | v95,41.02 94.36,41.02 94.11,40.77 94.11,40.35 U$8.6
  Bottom 0.254: v98.04,41.02 v95,41.02
BOM_E_LO2  (via drill 0.41)
  Top 0.254: LED2.C 105.68,45.36 | v97.66,42.93 97.79,43.05 97.79,43.94 98.04,44.2 105.41,44.2 105.65,44.44 LED2.C | J15.4 105.69,45.38 LED2.C | v92.46,42.42 v92.45,42.42 U$4.3
  Bottom 0.254: v97.66,42.93 97.16,42.42 v92.46,42.42
BOM_E_LO3  (via drill 0.41)
  Top 0.254: LED3.C 105.42,58.06 | LED3.C 105.4,57.14 105.16,56.9 98.3,56.9 98.04,56.64 98.04,47.12 v97.79,46.86 | J16.4 105.43,58.08 LED3.C | v94.36,46.86 94.11,46.61 94.11,45.3 U$4.6
  Bottom 0.254: v94.36,46.86 v97.79,46.86
BOM_EMIT0  (via drill 0.38)
  Top 0.203: R13.2 87.42,36.87 87.25,36.7 86.11,36.7 85.98,36.58 85.98,33.78 86.11,33.66 89.03,33.66 90.68,32 90.68,30.23 88.77,28.32 87,28.32 86.23,29.08 83.95,29.08 81.66,26.8 80.9,26.8 80.77,26.67 80.77,23.37 79.76,22.35 75.18,22.35 75.06,22.23 75.06,19.81 74.3,19.05 74.3,18.92 73.79,18.41 v72.64,18.41
  Bottom 0.203: v72.64,18.41 73.79,18.41 74.06,18.69 74.15,18.69 74.18,18.71 U1.3
BOM_EMIT1  (via drill 0.38)
  Top 0.203: v73.53,19.05 73.79,19.05 74.68,19.94 74.68,22.61 74.8,22.73 79.63,22.73 80.39,23.5 80.39,27.05 80.52,27.18 81.53,27.18 83.82,29.46 86.36,29.46 87.12,28.7 88.65,28.7 90.3,30.35 90.3,31.88 88.9,33.27 85.72,33.27 85.6,33.4 85.6,39.12 85.72,39.24 87.25,39.24 87.42,39.41 R14.2
  Bottom 0.203: U1.4 73.7,19.21 v73.53,19.05
BOM_EMIT2  (via drill 0.38)
  Top 0.203: v72.64,19.81 73.91,19.81 74.3,20.19 74.3,22.73 74.68,23.11 79.5,23.11 80.01,23.62 80.01,27.3 80.26,27.56 81.41,27.56 83.69,29.84 86.61,29.84 87.38,29.08 88.39,29.08 89.92,30.61 89.92,31.62 88.65,32.89 85.34,32.89 85.22,33.02 85.22,41.66 85.34,41.78 87.25,41.78 87.42,41.95 R15.2
  Bottom 0.203: U1.5 72.74,19.71 v72.64,19.81
BOM_EMIT3  (via drill 0.38)
  Top 0.203: v73.53,20.45 73.53,27.05 74.42,27.94 81.28,27.94 83.57,30.23 86.74,30.23 87.5,29.46 88.27,29.46 89.53,30.73 89.53,31.5 88.52,32.51 85.09,32.51 84.84,32.77 84.84,44.07 85.09,44.32 87.25,44.32 87.42,44.49 R16.2
  Bottom 0.203: U1.6 73.77,20.21 v73.53,20.45
BOM_SIG0  (via drill 0.38)
  Top 0.203: v103.89,24.64 103.93,24.59
  Top 0.254: J13.1 103.92,24.6 v103.89,24.64
  Bottom 0.203: U1.36 86.83,23.71 88.39,25.27 103.25,25.27 v103.89,24.64
BOM_SIG1
  Top 0.254: 104.31,37.16 R46.2 104.32,37.17 J14.1
BOM_SIG2
  Top 0.254: 104.31,49.86 R48.2 104.32,49.88 J15.1
BOM_SIG3
  Top 0.254: 104.18,62.56 R51.2 104.19,62.58 J16.1
BOOST1  (via drill 0.38)
  Top 0.254: U6.23 10.84,60.16 v11.18,59.82 | C3.1 28.23,64.86 v28.45,64.64
  Bottom 0.254: v28.45,64.64 28.32,64.77 26.29,64.77 25.53,64.01 12.32,64.01 11.68,63.37 11.68,62.99 11.18,62.48 v11.18,59.82
BOOST2  (via drill 0.38)
  Top 0.254: U6.20 10.84,58.21 v11.18,58.55 | C2.1 27.85,53.89 v27.94,53.98
  Bottom 0.254: v11.18,58.55 11.18,58.04 11.18,54.48 11.68,53.98 v27.94,53.98
D_POW_0
  Top 0.254: R32.1 104.19,21.38 C40.1 105.58,21.34 107.06,21.34 107.33,21.6 J13.3
D_POW_1
  Top 0.254: C41.1 105.75,34.16 | C41.1 104.19,33.95 R33.1 | J14.3 106.82,34.17 106.55,33.91 105.58,33.91 C41.1
D_POW_2
  Top 0.254: C42.1 105.75,46.86 | C42.1 104.19,46.65 R34.1 | J15.3 107.07,46.88 106.81,46.61 105.58,46.61 C42.1
D_POW_3
  Top 0.254: C43.1 105.75,59.56 | C43.1 104.19,59.35 R35.1 | J16.3 107.07,59.58 106.81,59.31 105.58,59.31 C43.1
DEBUG_RX_1.8V  (via drill 0.38)
  Top 0.203: U$16.GPIO165_IR_RXD3 43.44,40 43.31,40.13 42.29,40.13 41.91,40.51 41.91,41.02 41.78,41.15 40.77,41.15 40.39,40.77 39.75,40.77 39.5,40.51 39.5,39.88 39.37,39.75 31.5,39.75 29.34,37.59 29.34,35.56 30.61,34.29 31.88,34.29 32,34.16 33.91,32.26 34.54,32.26 35.18,31.62 35.18,30.73 36.7,29.21 38.35,29.21 v39.5,28.07
  Bottom 0.203: U11.6 57.73,30.04 57.53,29.84 56.64,29.84 56.39,29.59 55.63,29.59 54.48,28.45 54.48,28.19 53.47,27.18 51.56,27.18 51.44,27.05 51.44,26.8 50.93,26.29 48.77,26.29 48.26,25.78 46.35,25.78 45.59,26.54 45.59,27.56 45.34,27.81 39.75,27.81 v39.5,28.07
DEBUG_RX_3.3V
  Bottom 0.203: U11.15 71.32,30.04 71.63,30.35 74.8,30.35 74.93,30.48 JP6.2
DEBUG_TX_1.8V  (via drill 0.38)
  Top 0.203: U$16.GPIO166_IR_TXD3 43.03,38 42.67,38.35 41.27,38.35 40.64,38.99 31.75,38.99 30.1,37.34 30.1,35.81 30.86,35.05 32.13,35.05 34.16,33.02 34.8,33.02 35.94,31.88 35.94,30.99 36.96,29.97 39.62,29.97 42.29,27.3 v42.29,27.18
  Bottom 0.203: U11.5 56.7,29.39 56.52,29.21 55.75,29.21 54.99,28.45 54.99,28.19 53.59,26.8 51.94,26.8 51.05,25.91 48.9,25.91 48.39,25.4 46.1,25.4 45.21,26.29 45.21,27.05 45.09,27.18 v42.29,27.18